# EAGLE design regA_regB_and_ALU (EAGLE 9.6.1)
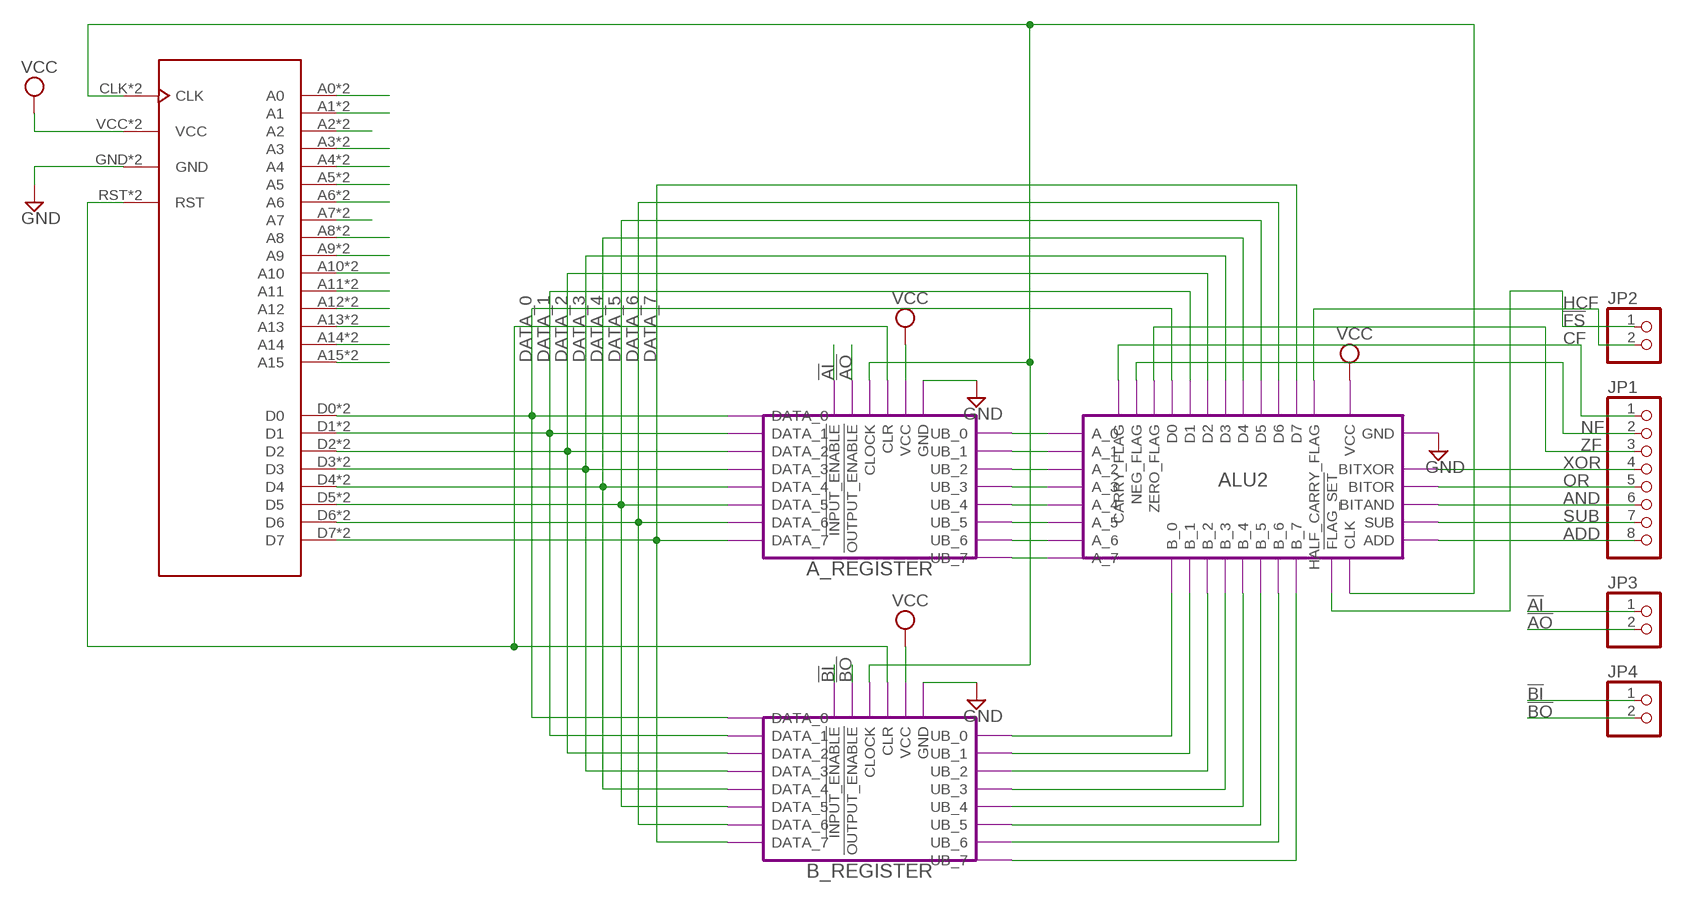
[diagram p0: schematic, sheet 1]

## Parts
JP1  PINHD-1X8/90  [1X08/90]
JP2  PINHD-1X2/90  [1X02/90]
JP3  PINHD-1X2/90  [1X02/90]
JP4  PINHD-1X2/90  [1X02/90]
U$1  PORT_BOARD  [PORT_FOOTPT]

## Module instances
A_REGISTER1 = DATA_REGISTOR
B_REGISTER1 = DATA_REGISTOR
ALU2 = ALU

## Nets
!AI: JP3.1 ; port A_REGISTER1.!INPUT_ENABLE
!AO: JP3.2 ; port A_REGISTER1.!OUTPUT_ENABLE
!BI: JP4.1 ; port B_REGISTER1.!INPUT_ENABLE
!BO: JP4.2 ; port B_REGISTER1.!OUTPUT_ENABLE
!FS: JP2.1 ; port ALU2.!FLAG_SET
ADD: JP1.8 ; port ALU2.ADD
AND: JP1.6 ; port ALU2.BITAND
CF: JP1.1 ; port ALU2.CARRY_FLAG
CLOCK1: U$1.CLK U$1.CLK1(CLK) ; port B_REGISTER1.CLOCK A_REGISTER1.CLOCK ALU2.CLK
DATA_0: U$1.D0 U$1.D8(D0) ; port A_REGISTER1.DATA_0 B_REGISTER1.DATA_0 ALU2.D0
DATA_1: U$1.D1 U$1.D9(D1) ; port A_REGISTER1.DATA_1 B_REGISTER1.DATA_1 ALU2.D1
DATA_2: U$1.D2 U$1.D10(D2) ; port A_REGISTER1.DATA_2 B_REGISTER1.DATA_2 ALU2.D2
DATA_3: U$1.D3 U$1.D11(D3) ; port A_REGISTER1.DATA_3 B_REGISTER1.DATA_3 ALU2.D3
DATA_4: U$1.D4 U$1.D12(D4) ; port A_REGISTER1.DATA_4 B_REGISTER1.DATA_4 ALU2.D4
DATA_5: U$1.D5 U$1.D13(D5) ; port A_REGISTER1.DATA_5 B_REGISTER1.DATA_5 ALU2.D5
DATA_6: U$1.D6 U$1.D14(D6) ; port A_REGISTER1.DATA_6 B_REGISTER1.DATA_6 ALU2.D6
DATA_7: U$1.D7 U$1.D15(D7) ; port A_REGISTER1.DATA_7 B_REGISTER1.DATA_7 ALU2.D7
GND: U$1.GND U$1.GND1(GND) ; port A_REGISTER1.GND B_REGISTER1.GND ALU2.GND
HCF: JP2.2 ; port ALU2.HALF_CARRY_FLAG
N$1: U$1.A15 U$1.A31(A15)
N$2: U$1.A14 U$1.A30(A14)
N$3: U$1.A13 U$1.A29(A13)
N$4: U$1.A12 U$1.A28(A12)
N$5: U$1.A11 U$1.A27(A11)
N$6: U$1.A10 U$1.A26(A10)
N$7: U$1.A9 U$1.A25(A9)
N$8: U$1.A8 U$1.A24(A8)
N$9: U$1.A7 U$1.A23(A7)
N$10: U$1.A6 U$1.A22(A6)
N$11: U$1.A5 U$1.A21(A5)
N$12: U$1.A4 U$1.A20(A4)
N$13: U$1.A3 U$1.A19(A3)
N$14: U$1.A2 U$1.A18(A2)
N$15: U$1.A1 U$1.A17(A1)
N$16: U$1.A0 U$1.A16(A0)
N$35: port A_REGISTER1.UB_0 ALU2.A_0
N$50: port A_REGISTER1.UB_1 ALU2.A_1
N$51: port A_REGISTER1.UB_2 ALU2.A_2
N$52: port A_REGISTER1.UB_3 ALU2.A_3
N$53: port A_REGISTER1.UB_4 ALU2.A_4
N$54: port A_REGISTER1.UB_5 ALU2.A_5
N$55: port A_REGISTER1.UB_6 ALU2.A_6
N$56: port A_REGISTER1.UB_7 ALU2.A_7
N$57: port B_REGISTER1.UB_0 ALU2.B_0
N$58: port B_REGISTER1.UB_1 ALU2.B_1
N$59: port ALU2.B_2 B_REGISTER1.UB_2
N$60: port B_REGISTER1.UB_3 ALU2.B_3
N$61: port ALU2.B_4 B_REGISTER1.UB_4
N$62: port B_REGISTER1.UB_5 ALU2.B_5
N$63: port ALU2.B_6 B_REGISTER1.UB_6
N$64: port B_REGISTER1.UB_7 ALU2.B_7
N$65: U$1.RST U$1.RST1(RST) ; port A_REGISTER1.CLR B_REGISTER1.CLR
NF: JP1.2 ; port ALU2.NEG_FLAG
OR: JP1.5 ; port ALU2.BITOR
SUB: JP1.7 ; port ALU2.SUB
VCC: U$1.VCC U$1.VCC1(VCC) ; port A_REGISTER1.VCC B_REGISTER1.VCC ALU2.VCC
XOR: JP1.4 ; port ALU2.BITXOR
ZF: JP1.3 ; port ALU2.ZERO_FLAG

## Library data of the parts
JP1 = pinhead:PINHD-1X8: PIN HEADER
JP2-JP4 = pinhead:PINHD-1X2: PIN HEADER
U$1 = stack_interface:PORT_BOARD

## Module DATA_REGISTOR
Ports: DATA_0(io) DATA_1(io) DATA_2(io) DATA_3(io) DATA_4(io) DATA_5(io) DATA_6(io) DATA_7(io) !INPUT_ENABLE(in) !OUTPUT_ENABLE(in) CLOCK(in) CLR(in) UB_0(out) UB_1(out) UB_2(out) UB_3(out) UB_4(out) UB_5(out) UB_6(out) UB_7(out) VCC(pwr) GND(pwr)
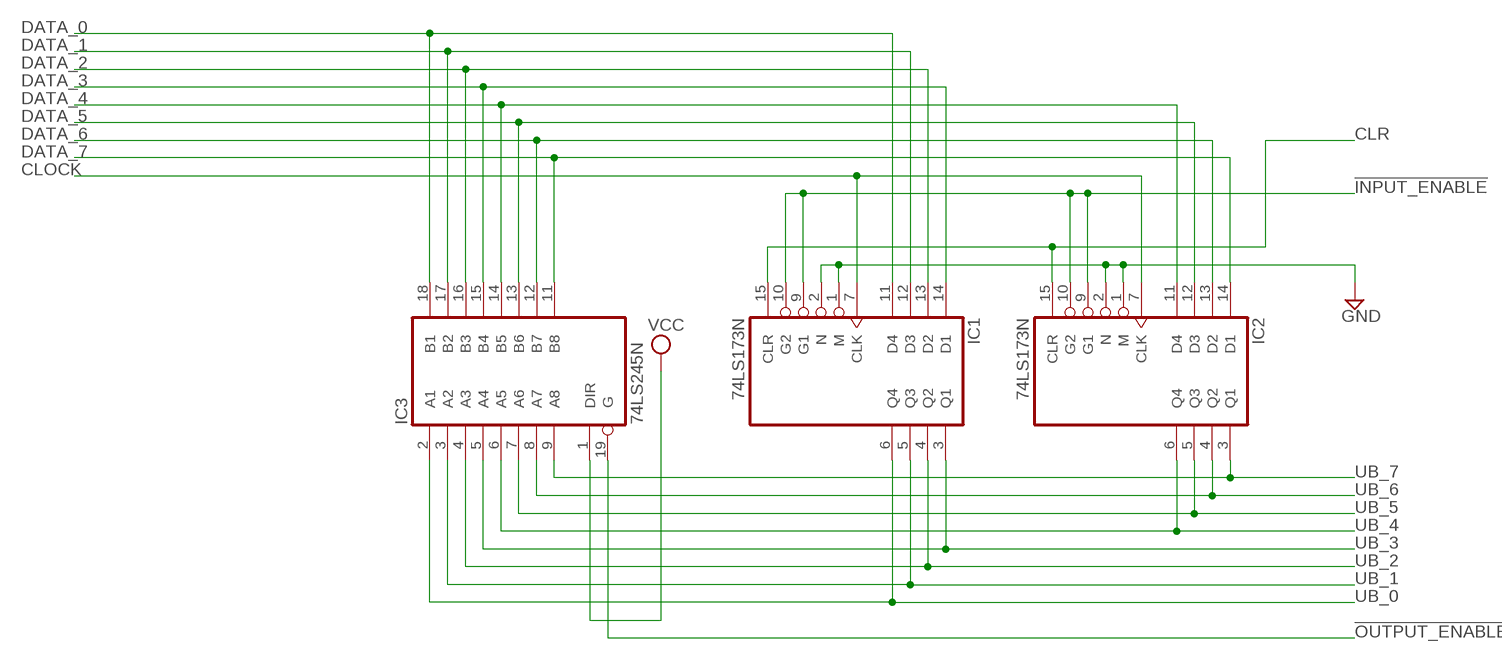
[diagram p1: schematic, module DATA_REGISTOR, sheet 1]

### Parts
IC1  74LS173N  [DIL16]
IC2  74LS173N  [DIL16]
IC3  74LS245N  [DIL20]

### Nets
!INPUT_ENABLE: IC1.9(G1) IC1.10(G2) IC2.9(G1) IC2.10(G2)
!OUTPUT_ENABLE: IC3.19(G)
CLOCK: IC1.7(CLK) IC2.7(CLK)
CLR: IC1.15(CLR) IC2.15(CLR)
DATA_0: IC1.11(D4) IC3.18(B1)
DATA_1: IC1.12(D3) IC3.17(B2)
DATA_2: IC1.13(D2) IC3.16(B3)
DATA_3: IC1.14(D1) IC3.15(B4)
DATA_4: IC2.11(D4) IC3.14(B5)
DATA_5: IC2.12(D3) IC3.13(B6)
DATA_6: IC2.13(D2) IC3.12(B7)
DATA_7: IC2.14(D1) IC3.11(B8)
GND: IC1.1(M) IC1.2(N) IC2.1(M) IC2.2(N)
UB_0: IC1.6(Q4) IC3.2(A1)
UB_1: IC1.5(Q3) IC3.3(A2)
UB_2: IC1.4(Q2) IC3.4(A3)
UB_3: IC1.3(Q1) IC3.5(A4)
UB_4: IC2.6(Q4) IC3.6(A5)
UB_5: IC2.5(Q3) IC3.7(A6)
UB_6: IC2.4(Q2) IC3.8(A7)
UB_7: IC2.3(Q1) IC3.9(A8)
VCC: IC3.1(DIR)

### Power pins joined to a net without a drawn wire
GND: IC1.8(GND) IC2.8(GND) IC3.10(GND)
VCC: IC1.16(VCC) IC2.16(VCC) IC3.20(VCC)

### Library data of the parts
IC1 IC2 = 74xx-eu:74*173: 4-bit D type REGISTER, 3-state
IC3 = 74xx-eu:74*245: Octal BUS TRANSCEIVER, 3-state

## Module ALU
Ports: A_0(in) A_1(in) A_2(in) A_3(in) A_4(in) A_5(in) A_6(in) A_7(in) B_0(in) B_1(in) B_2(in) B_3(in) B_4(in) B_5(in) B_6(in) B_7(in) ADD(in) SUB(in) BITAND(in) BITOR(in) BITXOR(in) D0(out) D1(out) D2(out) D3(out) D4(out) D5(out) D6(out) D7(out) GND(pwr) !FLAG_SET(in) CARRY_FLAG(out) NEG_FLAG(out) CLK(in) ZERO_FLAG(out) HALF_CARRY_FLAG(out) VCC(pwr)
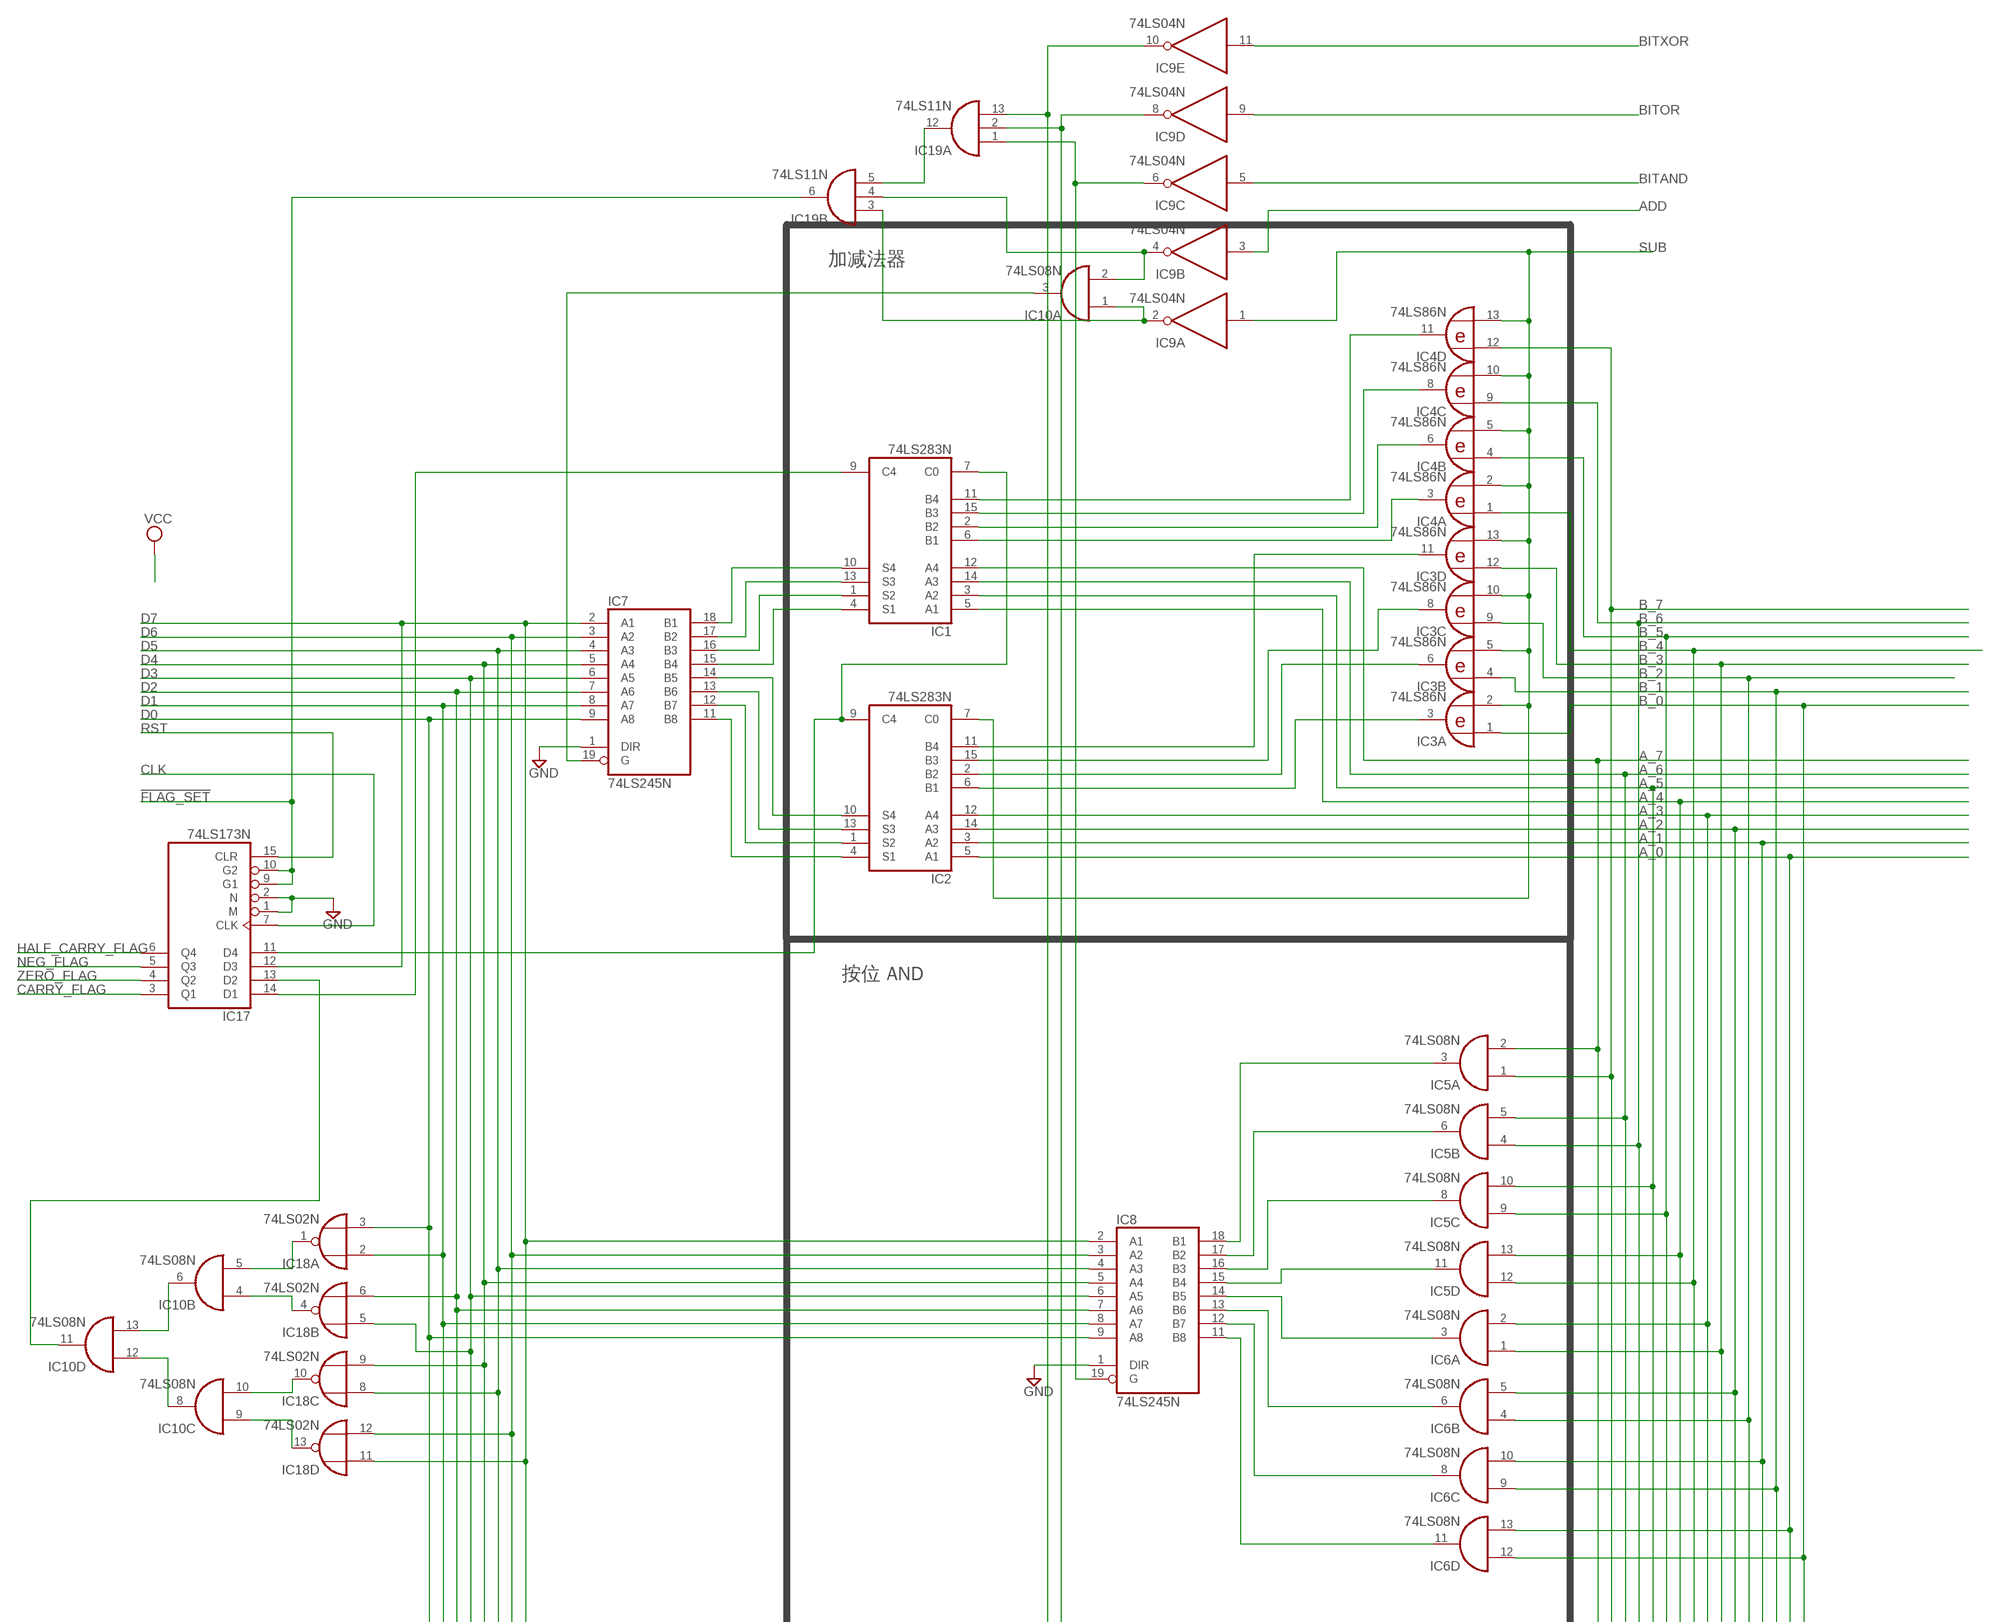
[diagram p2: schematic, module ALU, sheet 1, part 1 of 2]
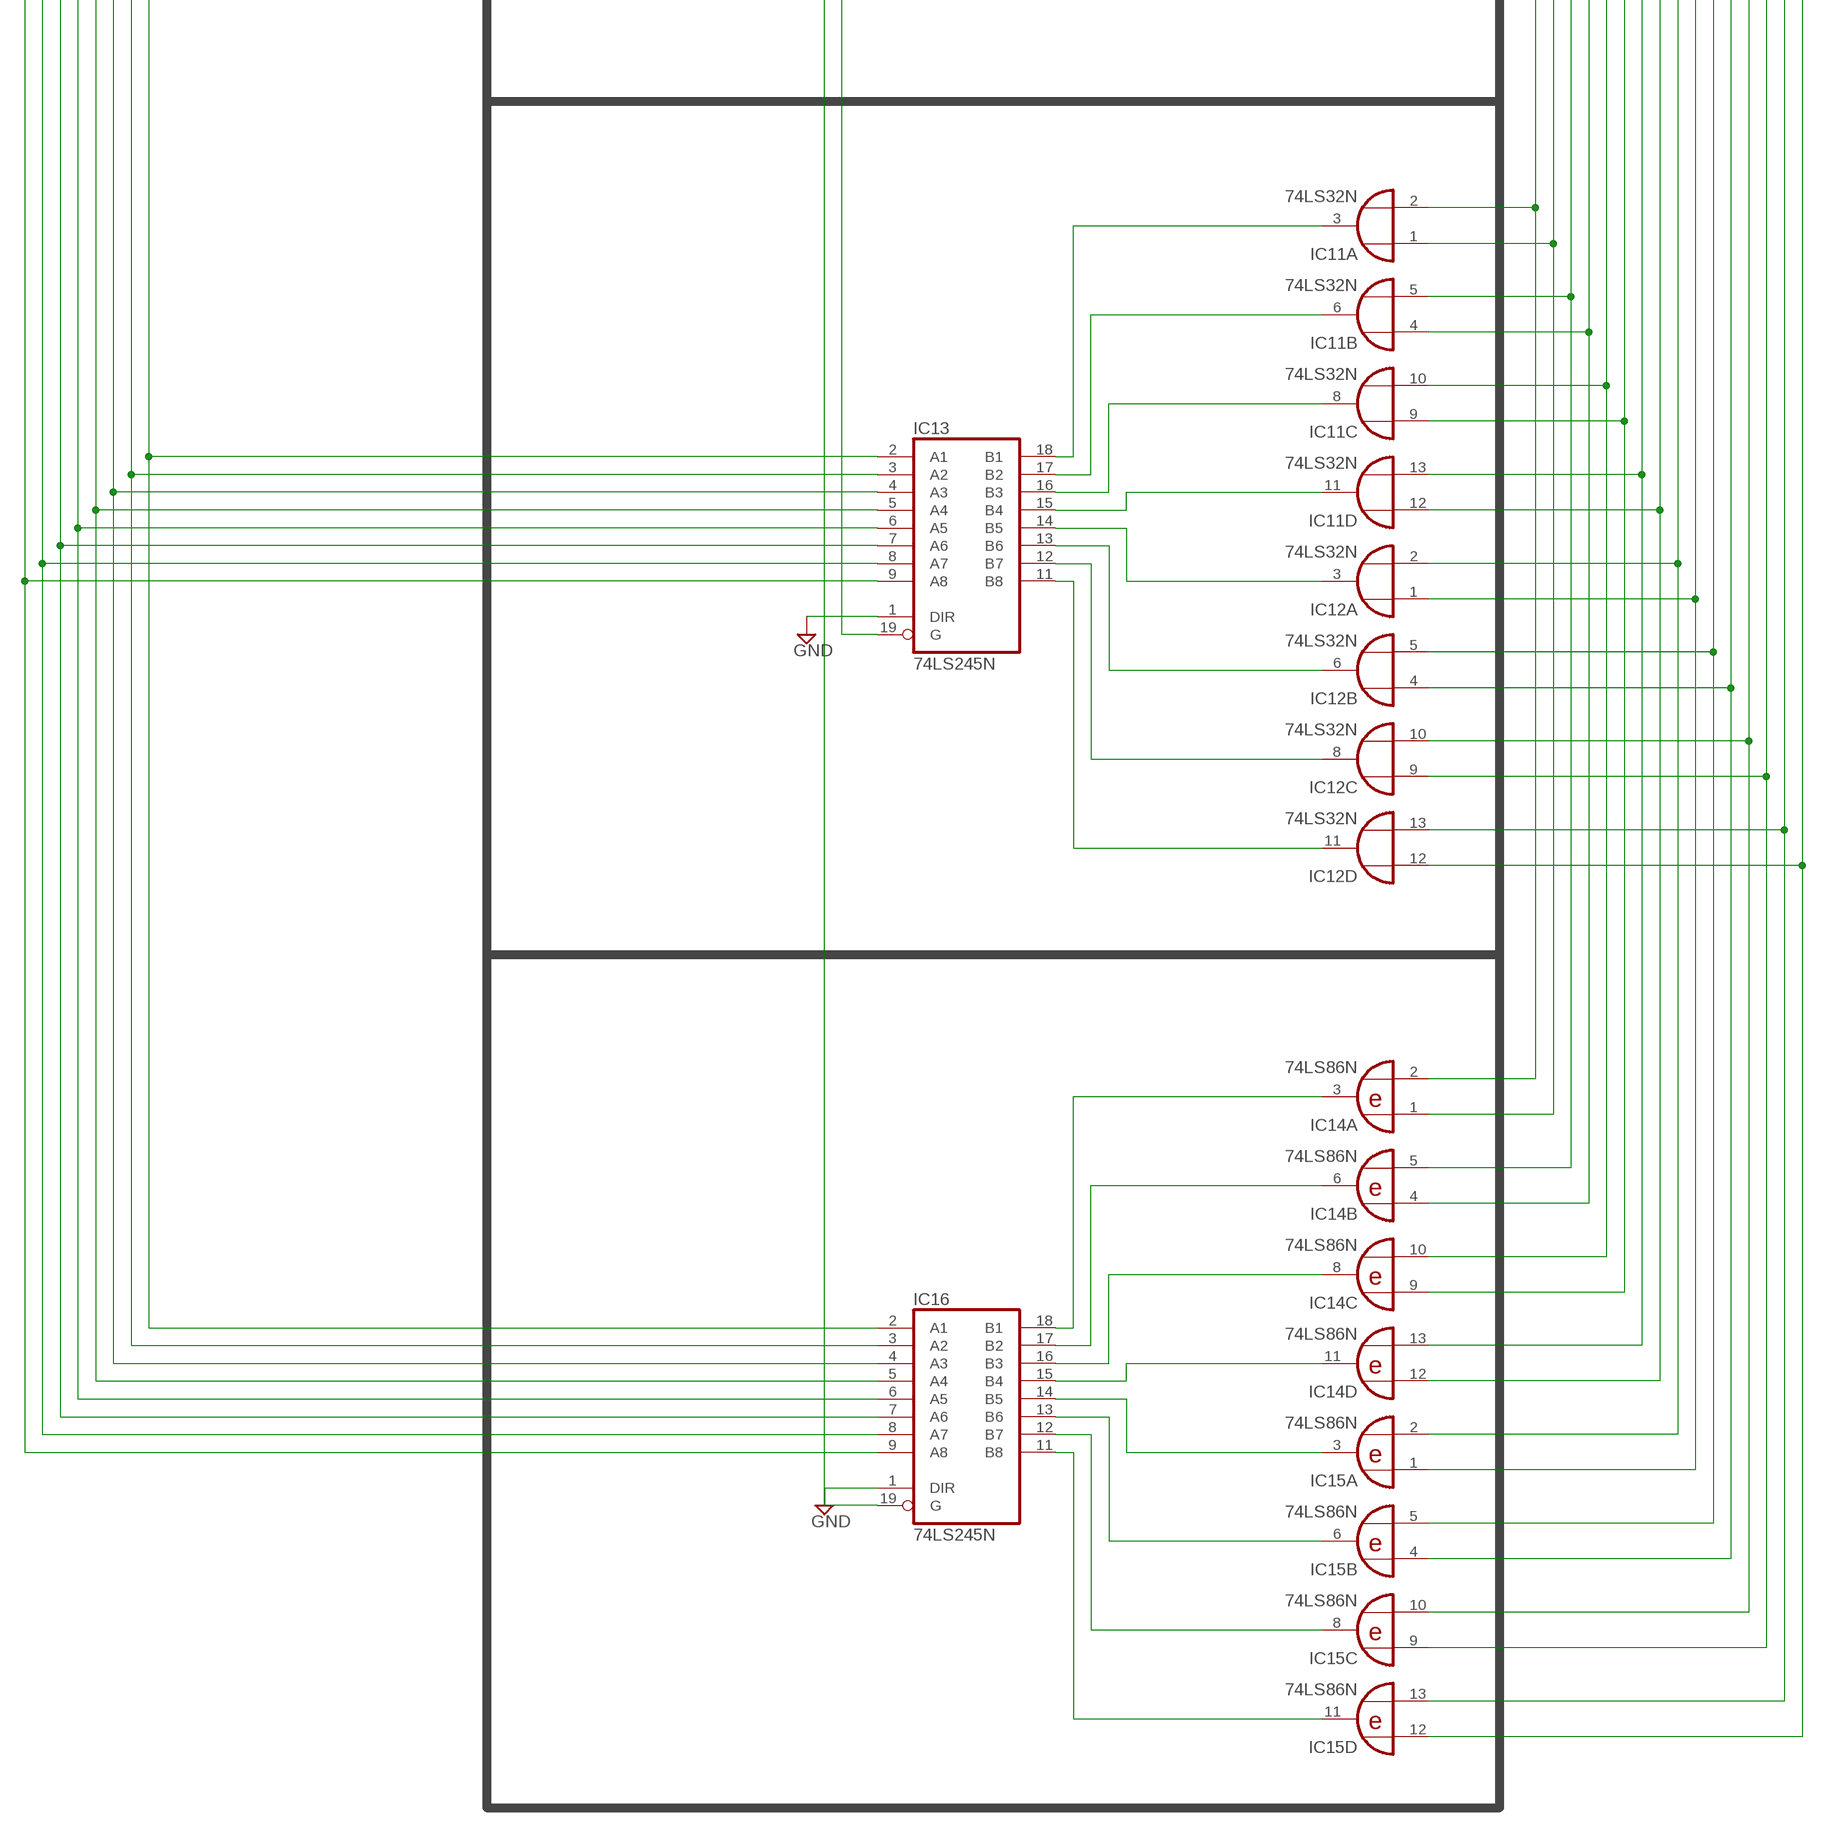
[diagram p3: schematic, module ALU, sheet 1, part 2 of 2]

### Parts
IC1  74LS283N  [DIL16]
IC2  74LS283N  [DIL16]
IC3  74LS86N  [DIL14]
IC4  74LS86N  [DIL14]
IC5  74LS08N  [DIL14]
IC6  74LS08N  [DIL14]
IC7  74LS245N  [DIL20]
IC8  74LS245N  [DIL20]
IC9  74LS04N  [DIL14]
IC10  74LS08N  [DIL14]
IC11  74LS32N  [DIL14]
IC12  74LS32N  [DIL14]
IC13  74LS245N  [DIL20]
IC14  74LS86N  [DIL14]
IC15  74LS86N  [DIL14]
IC16  74LS245N  [DIL20]
IC17  74LS173N  [DIL16]
IC18  74LS02N  [DIL14]
IC19  74LS11N  [DIL14]

### Nets
!FLAG_SET: IC17.9(G1) IC17.10(G2) IC19.6(B:O)
A_0: IC2.5(A1) IC6.13(D:I1) IC12.13(D:I1) IC15.13(D:I1)
A_1: IC2.3(A2) IC6.10(C:I1) IC12.10(C:I1) IC15.10(C:I1)
A_2: IC2.14(A3) IC6.5(B:I1) IC12.5(B:I1) IC15.5(B:I1)
A_3: IC2.12(A4) IC6.2(A:I1) IC12.2(A:I1) IC15.2(A:I1)
A_4: IC1.5(A1) IC5.13(D:I1) IC11.13(D:I1) IC14.13(D:I1)
A_5: IC1.3(A2) IC5.10(C:I1) IC11.10(C:I1) IC14.10(C:I1)
A_6: IC1.14(A3) IC5.5(B:I1) IC11.5(B:I1) IC14.5(B:I1)
A_7: IC1.12(A4) IC5.2(A:I1) IC11.2(A:I1) IC14.2(A:I1)
ADD: IC9.3(B:I)
B_0: IC3.1(A:I0) IC6.12(D:I0) IC12.12(D:I0) IC15.12(D:I0)
B_1: IC3.4(B:I0) IC6.9(C:I0) IC12.9(C:I0) IC15.9(C:I0)
B_2: IC3.9(C:I0) IC6.4(B:I0) IC12.4(B:I0) IC15.4(B:I0)
B_3: IC3.12(D:I0) IC6.1(A:I0) IC12.1(A:I0) IC15.1(A:I0)
B_4: IC4.1(A:I0) IC5.12(D:I0) IC11.12(D:I0) IC14.12(D:I0)
B_5: IC4.4(B:I0) IC5.9(C:I0) IC11.9(C:I0) IC14.9(C:I0)
B_6: IC4.9(C:I0) IC5.4(B:I0) IC11.4(B:I0) IC14.4(B:I0)
B_7: IC4.12(D:I0) IC5.1(A:I0) IC11.1(A:I0) IC14.1(A:I0)
BITAND: IC9.5(C:I)
BITOR: IC9.9(D:I)
BITXOR: IC9.11(E:I)
CARRY_FLAG: IC17.3(Q1)
CLK: IC17.7(CLK)
D0: IC7.9(A8) IC8.9(A8) IC13.9(A8) IC16.9(A8) IC18.3(A:I1)
D1: IC7.8(A7) IC8.8(A7) IC13.8(A7) IC16.8(A7) IC18.2(A:I0)
D2: IC7.7(A6) IC8.7(A6) IC13.7(A6) IC16.7(A6) IC18.6(B:I1)
D3: IC7.6(A5) IC8.6(A5) IC13.6(A5) IC16.6(A5) IC18.5(B:I0)
D4: IC7.5(A4) IC8.5(A4) IC13.5(A4) IC16.5(A4) IC18.9(C:I1)
D5: IC7.4(A3) IC8.4(A3) IC13.4(A3) IC16.4(A3) IC18.8(C:I0)
D6: IC7.3(A2) IC8.3(A2) IC13.3(A2) IC16.3(A2) IC18.12(D:I1)
D7: IC7.2(A1) IC8.2(A1) IC13.2(A1) IC16.2(A1) IC17.12(D3) IC18.11(D:I0)
GND: IC7.1(DIR) IC8.1(DIR) IC13.1(DIR) IC16.1(DIR) IC17.1(M) IC17.2(N)
HALF_CARRY_FLAG: IC17.6(Q4)
N$1: IC1.7(C0) IC2.9(C4) IC17.11(D4)
N$2: IC2.10(S4) IC7.14(B5)
N$3: IC1.4(S1) IC7.15(B4)
N$4: IC2.4(S1) IC7.11(B8)
N$5: IC2.1(S2) IC7.12(B7)
N$6: IC2.13(S3) IC7.13(B6)
N$7: IC1.1(S2) IC7.16(B3)
N$8: IC1.13(S3) IC7.17(B2)
N$9: IC1.10(S4) IC7.18(B1)
N$10: IC2.6(B1) IC3.3(A:O)
N$11: IC2.2(B2) IC3.6(B:O)
N$12: IC2.15(B3) IC3.8(C:O)
N$13: IC2.11(B4) IC3.11(D:O)
N$14: IC1.6(B1) IC4.3(A:O)
N$15: IC1.2(B2) IC4.6(B:O)
N$16: IC1.15(B3) IC4.8(C:O)
N$17: IC1.11(B4) IC4.11(D:O)
N$18: IC5.3(A:O) IC8.18(B1)
N$19: IC5.6(B:O) IC8.17(B2)
N$20: IC5.8(C:O) IC8.16(B3)
N$21: IC5.11(D:O) IC8.15(B4)
N$22: IC6.3(A:O) IC8.14(B5)
N$23: IC6.6(B:O) IC8.13(B6)
N$24: IC6.8(C:O) IC8.12(B7)
N$25: IC6.11(D:O) IC8.11(B8)
N$26: IC9.2(A:O) IC10.1(A:I0) IC19.3(B:I0)
N$27: IC9.4(B:O) IC10.2(A:I1) IC19.4(B:I1)
N$28: IC7.19(G) IC10.3(A:O)
N$29: IC8.19(G) IC9.6(C:O) IC19.1(A:I0)
N$30: IC11.3(A:O) IC13.18(B1)
N$31: IC14.3(A:O) IC16.18(B1)
N$32: IC11.8(C:O) IC13.16(B3)
N$33: IC11.11(D:O) IC13.15(B4)
N$34: IC12.3(A:O) IC13.14(B5)
N$35: IC12.6(B:O) IC13.13(B6)
N$36: IC12.8(C:O) IC13.12(B7)
N$37: IC12.11(D:O) IC13.11(B8)
N$38: IC9.8(D:O) IC13.19(G) IC19.2(A:I1)
N$39: IC11.6(B:O) IC13.17(B2)
N$40: IC14.6(B:O) IC16.17(B2)
N$41: IC14.8(C:O) IC16.16(B3)
N$42: IC14.11(D:O) IC16.15(B4)
N$43: IC15.3(A:O) IC16.14(B5)
N$44: IC15.6(B:O) IC16.13(B6)
N$45: IC15.8(C:O) IC16.12(B7)
N$46: IC15.11(D:O) IC16.11(B8)
N$47: IC9.10(E:O) IC16.19(G) IC19.13(A:I2)
N$48: IC1.9(C4) IC17.14(D1)
N$49: IC10.6(B:O) IC10.13(D:I1)
N$50: IC10.8(C:O) IC10.12(D:I0)
N$51: IC10.5(B:I1) IC18.1(A:O)
N$52: IC10.4(B:I0) IC18.4(B:O)
N$53: IC10.10(C:I1) IC18.10(C:O)
N$54: IC10.9(C:I0) IC18.13(D:O)
N$55: IC10.11(D:O) IC17.13(D2)
N$56: IC19.5(B:I2) IC19.12(A:O)
NEG_FLAG: IC17.5(Q3)
RST: IC17.15(CLR)
SUB: IC2.7(C0) IC3.2(A:I1) IC3.5(B:I1) IC3.10(C:I1) IC3.13(D:I1) IC4.2(A:I1) IC4.5(B:I1) IC4.10(C:I1) IC4.13(D:I1) IC9.1(A:I)
ZERO_FLAG: IC17.4(Q2)
Unconnected: IC9.12(F:O) IC9.13(F:I) IC19.8(C:O) IC19.9(C:I0) IC19.10(C:I1) IC19.11(C:I2)

### Notes on the sheet
- 加减法器
- 按位 AND

### Power pins joined to a net without a drawn wire
GND: IC1.8(GND) IC2.8(GND) IC3.7(P:GND) IC4.7(P:GND) IC5.7(P:GND) IC6.7(P:GND) IC7.10(GND) IC8.10(GND) IC9.7(P:GND) IC10.7(P:GND) IC11.7(P:GND) IC12.7(P:GND) IC13.10(GND) IC14.7(P:GND) IC15.7(P:GND) IC16.10(GND) IC17.8(GND) IC18.7(P:GND) IC19.7(P:GND)
VCC: IC1.16(VCC) IC2.16(VCC) IC3.14(P:VCC) IC4.14(P:VCC) IC5.14(P:VCC) IC6.14(P:VCC) IC7.20(VCC) IC8.20(VCC) IC9.14(P:VCC) IC10.14(P:VCC) IC11.14(P:VCC) IC12.14(P:VCC) IC13.20(VCC) IC14.14(P:VCC) IC15.14(P:VCC) IC16.20(VCC) IC17.16(VCC) IC18.14(P:VCC) IC19.14(P:VCC)

### Library data of the parts
IC1 IC2 = 74xx-eu:74*283: 4-bit binary FULL ADDER, fast carry
IC3 IC4 IC14 IC15 = 74xx-eu:74*86: Quad 2-input EXCLUSIVE-OR (XOR) gate
IC5 IC6 IC10 = 74xx-eu:74*08: Quad 2-input AND gate
IC7 IC8 IC13 IC16 = 74xx-eu:74*245: Octal BUS TRANSCEIVER, 3-state
IC9 = 74xx-eu:74*04: Hex INVERTER
IC11 = 74xx-eu:74*32: Quad 2-input OR gate; SPICEPREFIX: J
IC12 = 74xx-eu:74*32: Quad 2-input OR gate
IC17 = 74xx-eu:74*173: 4-bit D type REGISTER, 3-state
IC18 = 74xx-eu:74*02: Quad 2-input NOR gate
IC19 = 74xx-eu:74*11: Triple 3-input AND gate

## Board
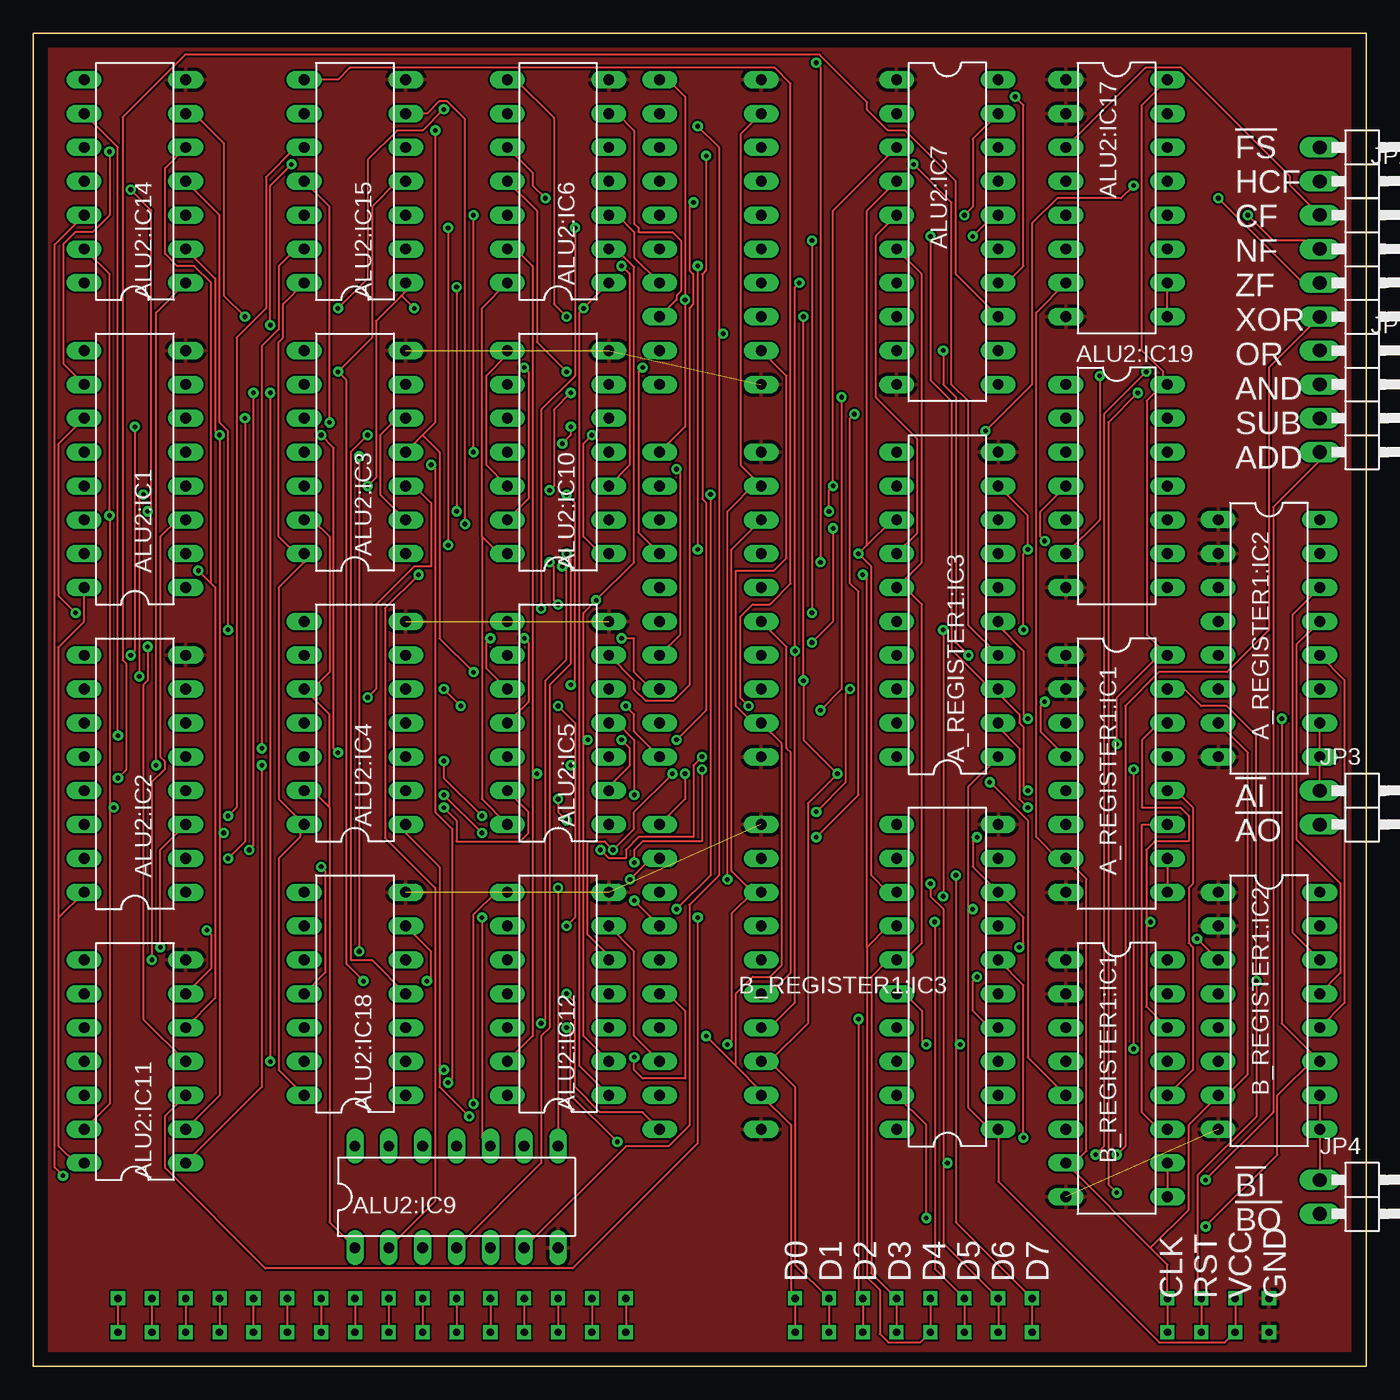
[diagram p4: board, top side]
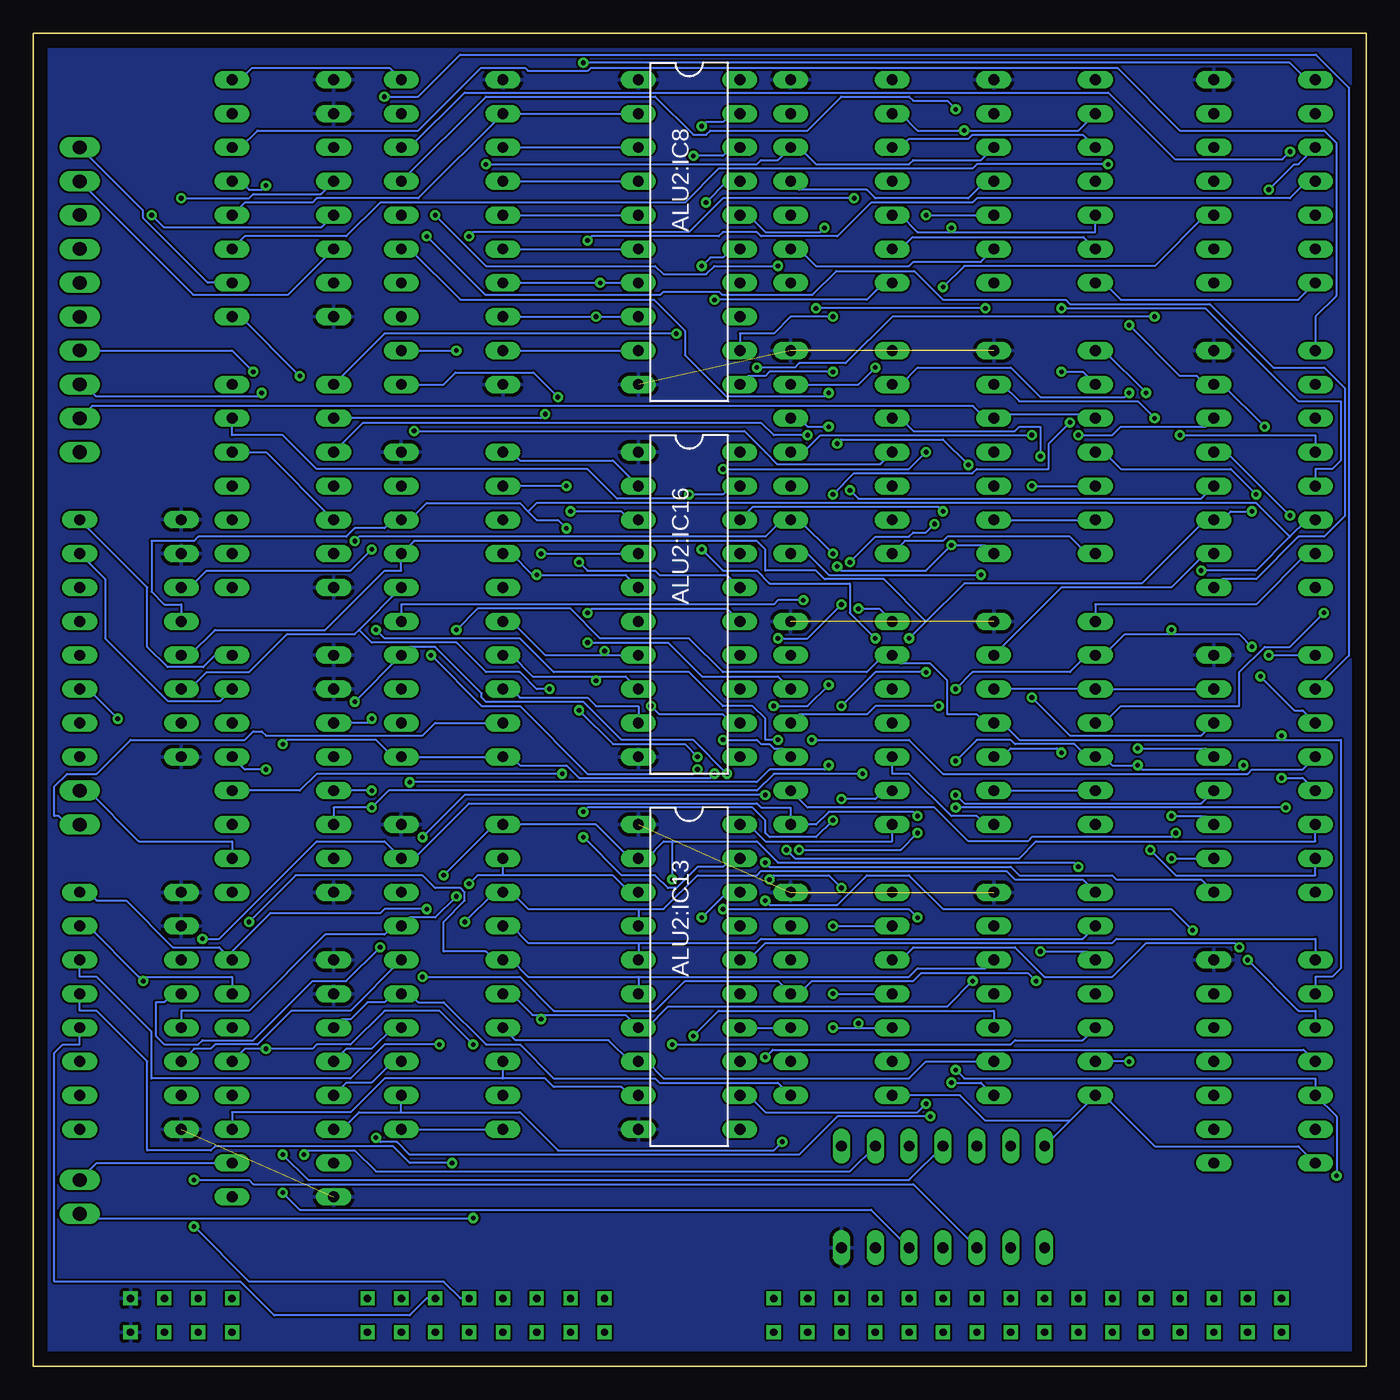
[diagram p5: board, bottom side, seen from below]

Size 100 x 100 mm. Coordinates in mm from the lower left corner, seen from the top.
Copper layers (1*16): Top 0.035mm / dielectric 1.5mm / Bottom 0.035mm
Design rules "default": minimum track width 6mil, minimum drill 0.35mm, track to track 6mil, track to pad 6mil, pad to pad 6mil, via to via 6mil, smd to smd 6mil, copper to edge 40mil, drill to drill 6mil, minimum pad ring 10mil, minimum via ring 8mil, stop-mask expansion 4mil, vias tented up to drill 0mil, thermal gap 10mil

### Footprints (pad centres in the part's own frame; a part is rotated, then mirrored left to right if it is on the bottom)
DIL16 = drill 0.813 long: 1 -8.89,-3.81; 2 -6.35,-3.81; 3 -3.81,-3.81; 4 -1.27,-3.81; 5 1.27,-3.81; 6 3.81,-3.81; 7 6.35,-3.81; 8 8.89,-3.81; 9 8.89,3.81; 10 6.35,3.81; 11 3.81,3.81; 12 1.27,3.81; 13 -1.27,3.81; 14 -3.81,3.81; 15 -6.35,3.81; 16 -8.89,3.81
DIL20 = drill 0.813 long: 1 -11.43,-3.81; 2 -8.89,-3.81; 3 -6.35,-3.81; 4 -3.81,-3.81; 5 -1.27,-3.81; 6 1.27,-3.81; 7 3.81,-3.81; 8 6.35,-3.81; 9 8.89,-3.81; 10 11.43,-3.81; 11 11.43,3.81; 12 8.89,3.81; 13 6.35,3.81; 14 3.81,3.81; 15 1.27,3.81; 16 -1.27,3.81; 17 -3.81,3.81; 18 -6.35,3.81; 19 -8.89,3.81; 20 -11.43,3.81
DIL14 = drill 0.813 long: 1 -7.62,-3.81; 2 -5.08,-3.81; 3 -2.54,-3.81; 4 0,-3.81; 5 2.54,-3.81; 6 5.08,-3.81; 7 7.62,-3.81; 8 7.62,3.81; 9 5.08,3.81; 10 2.54,3.81; 11 0,3.81; 12 -2.54,3.81; 13 -5.08,3.81; 14 -7.62,3.81
1X08/90 = drill 1.016 long: 1 -8.89,-3.81; 2 -6.35,-3.81; 3 -3.81,-3.81; 4 -1.27,-3.81; 5 1.27,-3.81; 6 3.81,-3.81; 7 6.35,-3.81; 8 8.89,-3.81
1X02/90 = drill 1.016 long: 1 -1.27,-3.81; 2 1.27,-3.81
PORT_FOOTPT = drill 0.55 square: A0 6.35,2.54; A1 8.89,2.54; A2 11.43,2.54; A3 13.97,2.54; A4 16.51,2.54; A5 19.05,2.54; A6 21.59,2.54; A7 24.13,2.54; A8 26.67,2.54; A9 29.21,2.54; A10 31.75,2.54; A11 34.29,2.54; A12 36.83,2.54; A13 39.37,2.54; A14 41.91,2.54; A15 44.45,2.54; A16 6.35,5.08; A17 8.89,5.08; A18 11.43,5.08; A19 13.97,5.08; A20 16.51,5.08; A21 19.05,5.08; A22 21.59,5.08; A23 24.13,5.08; A24 26.67,5.08; A25 29.21,5.08; A26 31.75,5.08; A27 34.29,5.08; A28 36.83,5.08; A29 39.37,5.08; A30 41.91,5.08; A31 44.45,5.08; CLK 85.09,2.54; CLK1 85.09,5.08; D0 57.15,2.54; D1 59.69,2.54; D2 62.23,2.54; D3 64.77,2.54; D4 67.31,2.54; D5 69.85,2.54; D6 72.39,2.54; D7 74.93,2.54; D8 57.15,5.08; D9 59.69,5.08; D10 62.23,5.08; D11 64.77,5.08; D12 67.31,5.08; D13 69.85,5.08; D14 72.39,5.08; D15 74.93,5.08; GND 92.71,2.54; GND1 92.71,5.08; RST 87.63,2.54; RST1 87.63,5.08; VCC 90.17,2.54; VCC1 90.17,5.08

### Placement (x,y rotation side)
A_REGISTER1:IC1  74LS173N  [DIL16]  81.28,44.45 270 top
A_REGISTER1:IC2  74LS173N  [DIL16]  92.71,54.61 270 top
A_REGISTER1:IC3  74LS245N  [DIL20]  68.58,57.15 90 top
ALU2:IC1  74LS283N  [DIL16]  7.62,67.31 90 top
ALU2:IC2  74LS283N  [DIL16]  7.62,44.45 90 top
ALU2:IC3  74LS86N  [DIL14]  24.13,68.58 90 top
ALU2:IC4  74LS86N  [DIL14]  24.13,48.26 90 top
ALU2:IC5  74LS08N  [DIL14]  39.37,48.26 90 top
ALU2:IC6  74LS08N  [DIL14]  39.37,88.9 90 top
ALU2:IC7  74LS245N  [DIL20]  68.58,85.09 270 top
ALU2:IC8  74LS245N  [DIL20]  50.8,85.09 270 bottom
ALU2:IC9  74LS04N  [DIL14]  31.75,12.7 0 top
ALU2:IC10  74LS08N  [DIL14]  39.37,68.58 90 top
ALU2:IC11  74LS32N  [DIL14]  7.62,22.86 90 top
ALU2:IC12  74LS32N  [DIL14]  39.37,27.94 90 top
ALU2:IC13  74LS245N  [DIL20]  50.8,29.21 270 bottom
ALU2:IC14  74LS86N  [DIL14]  7.62,88.9 90 top
ALU2:IC15  74LS86N  [DIL14]  24.13,88.9 90 top
ALU2:IC16  74LS245N  [DIL20]  50.8,57.15 270 bottom
ALU2:IC17  74LS173N  [DIL16]  81.28,87.63 270 top
ALU2:IC18  74LS02N  [DIL14]  24.13,27.94 90 top
ALU2:IC19  74LS11N  [DIL14]  81.28,66.04 270 top
B_REGISTER1:IC1  74LS173N  [DIL16]  81.28,21.59 270 top
B_REGISTER1:IC2  74LS173N  [DIL16]  92.71,26.67 270 top
B_REGISTER1:IC3  74LS245N  [DIL20]  68.58,29.21 90 top
JP1  100.33,77.47 270 top
JP2  100.33,90.17 270 top
JP3  100.33,41.91 270 top
JP4  100.33,12.7 270 top
U$1  0,0 0 top

### Tracks (layer width: path | path; a pad name or v marks a point on that pad's centre or on a via)
!AI
  Top 0.152: A_REGISTER1:IC1.10 A_REGISTER1:IC1.9 | JP3.1 A_REGISTER1:IC2.9 A_REGISTER1:IC2.10
  Bottom 0.152: A_REGISTER1:IC1.10 85.09,39.37 92.08,39.37 95.89,43.18 JP3.1
!AO
  Bottom 0.152: A_REGISTER1:IC3.19 69.85,48.26 70.8,47.31 82.55,47.31 82.87,47.62 83.5,47.62 84.14,46.99 92.71,46.99 95.25,44.45 97.47,44.45 98.42,43.5 98.42,41.27 98.11,41.27 97.47,40.64 JP3.2
!BI
  Top 0.152: B_REGISTER1:IC1.10 B_REGISTER1:IC1.9 | B_REGISTER1:IC2.10 B_REGISTER1:IC2.9 JP4.1
  Bottom 0.152: B_REGISTER1:IC1.10 95.25,15.24 JP4.1
!BO  (via drill 0.35)
  Top 0.152: B_REGISTER1:IC3.19 66.99,18.1 v66.99,11.11
  Bottom 0.152: v66.99,11.11 96.2,11.11 JP4.2
!FS  (via drill 0.35)
  Top 0.152: ALU2:IC19.6 80.01,63.5 v80.01,74.3 | ALU2:IC17.9 ALU2:IC17.10
  Bottom 0.152: v80.01,74.3 84.45,78.74 ALU2:IC17.9 | JP2.1 91.76,86.68 91.76,86.14 86.9,81.28 ALU2:IC17.10
ADD  (via drill 0.35)
  Top 0.152: v87.95,13.97 93.03,19.05 93.03,64.45 96.52,67.95 JP1.8
  Bottom 0.152: ALU2:IC9.3 33.97,13.65 83.5,13.65 83.82,13.97 v87.95,13.97
ALU2:N$1  (via drill 0.35)
  Top 0.152: v7.3,53.34 7.62,53.66 v7.62,70.48 | v19.37,90.17 17.78,88.58 v17.78,78.11
  Bottom 0.152: v7.3,53.34 ALU2:IC2.9 | v7.62,70.48 10.8,73.66 ALU2:IC1.7 12.06,73.66 12.7,74.3 13.97,74.3 v17.78,78.11 | ALU2:IC17.11 84.14,84.77 76.52,84.77 73.98,87.31 51.12,87.31 48.58,89.85 29.53,89.85 29.21,90.17 v19.37,90.17
ALU2:N$2  (via drill 0.35)
  Top 0.152: v73.66,95.25 74.3,94.62 74.3,82.55 73.03,81.28 ALU2:IC7.14
  Bottom 0.152: v73.66,95.25 71.12,95.25 67.97,98.4 3.77,98.4 1.3,95.92 1.3,53.31 ALU2:IC2.10
ALU2:N$3  (via drill 0.35)
  Top 0.152: v38.73,65.72 39.05,66.04 39.05,71.76 v40.32,73.03
  Bottom 0.152: ALU2:IC1.4 12.38,65.09 38.1,65.09 v38.73,65.72 | ALU2:IC7.15 71.75,83.82 67.94,80.01 53.43,80.01 51.12,77.69 51.12,75.87 48.02,72.77 40.58,72.77 v40.32,73.03
ALU2:N$4  (via drill 0.35)
  Top 0.152: v33.66,40 v30.8,42.86 | v42.55,38.73 43.18,38.1 44.45,38.1 44.45,38.73 45.4,39.69 49.53,39.69 49.53,45.08 v50.16,45.72 | v59.05,49.21 60.64,50.8 v60.64,72.71
  Bottom 0.152: ALU2:IC2.4 12.38,42.23 30.16,42.23 v30.8,42.86 | v33.66,40 34.92,38.73 v42.55,38.73 | v50.16,45.72 51.12,46.67 56.52,46.67 v59.05,49.21 | v60.64,72.71 62.48,74.55 68.33,74.55 69.22,73.66 ALU2:IC7.11
ALU2:N$5  (via drill 0.35)
  Top 0.152: v45.09,37.78 45.09,38.73 45.72,39.37 50.16,39.37 v50.16,44.77 | v70.17,53.34 69.22,54.29 69.22,72.71 68.26,73.66 v68.26,76.2
  Bottom 0.152: ALU2:IC2.1 12.38,36.51 18.73,36.51 19.05,36.83 26.03,36.83 26.67,37.46 44.77,37.46 v45.09,37.78 | v50.16,44.77 50.48,44.45 58.42,44.45 63.5,49.53 66.36,49.53 v70.17,53.34 | ALU2:IC7.12 v68.26,76.2
ALU2:N$6  (via drill 0.35)
  Top 0.152: ALU2:IC7.13 69.22,81.92 69.22,88.91 65.42,92.71 64.12,92.71 62.55,94.29 62.55,94.84 58.99,98.4 11.39,98.4 6.7,93.7 6.7,52.99 6.96,52.73 6.96,44.74 v6.35,44.13
  Bottom 0.152: ALU2:IC2.13 4.76,44.13 v6.35,44.13
ALU2:N$7  (via drill 0.35)
  Top 0.152: v70.48,84.77 72.07,86.36 ALU2:IC7.16
  Bottom 0.152: ALU2:IC1.1 10.8,59.05 8.25,59.05 5.08,62.23 3.16,62.23 1.6,63.79 1.6,73.37 3.16,74.93 6.98,74.93 11.75,79.69 22.22,79.69 22.54,80.01 31.75,80.01 33.91,82.17 39.75,82.17 41.53,80.39 48.32,80.39 48.55,80.62 52.73,80.62 52.96,80.39 66.1,80.39 v70.48,84.77
ALU2:N$8  (via drill 0.35)
  Top 0.152: v22.86,79.38 25.08,81.6 25.08,90.5 27.29,92.71 29.21,92.71 v30.8,94.3
  Bottom 0.152: ALU2:IC1.13 3.81,67.31 2.54,67.31 1.91,67.95 1.91,72.39 5.08,72.39 12.06,79.38 v22.86,79.38 | v30.8,94.3 31.43,94.93 33.97,94.93 34.29,95.25 39.37,95.25 41.91,92.71 49.21,92.71 49.53,92.39 50.48,92.39 53.34,95.25 66.04,95.25 ALU2:IC7.17
ALU2:N$9  (via drill 0.35)
  Top 0.152: v5.72,91.12 5.72,86.35 4.46,85.09 3.16,85.09 2.26,84.19 2.26,75.21 ALU2:IC1.10
  Bottom 0.152: ALU2:IC7.18 71.75,91.44 67.64,95.56 19.36,95.56 14.35,90.55 6.29,90.55 v5.72,91.12
ALU2:N$10  (via drill 0.35)
  Top 0.152: v25.08,50.16 25.72,50.8 25.72,57.15 28.58,60.01 29.84,60.01 29.84,64.77 28.58,66.04 ALU2:IC3.3
  Bottom 0.152: ALU2:IC2.6 12.38,47.31 22.22,47.31 v25.08,50.16
ALU2:N$11  (via drill 0.35)
  Top 0.152: v14.61,38.1 15.88,39.37 v15.88,71.12
  Bottom 0.152: v14.61,38.1 ALU2:IC2.2 | v15.88,71.12 17.14,72.39 26.03,72.39 27.31,73.66 ALU2:IC3.6
ALU2:N$12  (via drill 0.35)
  Top 0.152: v16.19,38.73 16.51,39.05 v16.51,73.03
  Bottom 0.152: ALU2:IC2.15 3.81,36.83 14.29,36.83 v16.19,38.73 | v16.51,73.03 19.69,76.2 ALU2:IC3.8
ALU2:N$13  (via drill 0.35)
  Top 0.152: v7.94,51.75 7.94,65.09 v8.25,65.41
  Bottom 0.152: ALU2:IC2.11 4.76,49.21 5.4,49.21 v7.94,51.75 | v8.25,65.41 10.16,67.31 18.42,67.31 19.69,68.58 ALU2:IC3.11
ALU2:N$14  (via drill 0.35)
  Top 0.152: v21.59,69.85 22.54,68.9 22.54,46.35 v22.86,46.04
  Bottom 0.152: ALU2:IC1.6 12.06,70.48 18.42,70.48 19.05,69.85 v21.59,69.85 | v22.86,46.04 23.18,46.35 26.67,46.35 27.31,45.72 ALU2:IC4.3
ALU2:N$15
  Bottom 0.152: ALU2:IC4.6 22.86,58.42 14.61,58.42 12.06,60.96 ALU2:IC1.2
ALU2:N$16
  Bottom 0.152: ALU2:IC4.8 20.32,57.15 8.25,57.15 4.45,60.96 ALU2:IC1.15
ALU2:N$17  (via drill 0.35)
  Top 0.152: ALU2:IC1.11 1.91,69.22 1.91,57.78 v3.17,56.51
  Bottom 0.152: v3.17,56.51 5.72,53.97 7.62,53.97 9.53,52.07 9.53,49.53 18.42,49.53 19.69,48.26 ALU2:IC4.11
ALU2:N$18  (via drill 0.35)
  Top 0.152: v50.48,90.81 50.48,82.23 50.19,81.94 50.19,65.06 50.45,64.8 50.45,49.18 v48.26,46.99
  Bottom 0.152: ALU2:IC5.3 43.81,46.35 44.45,46.35 44.77,46.67 45.4,46.67 45.72,46.99 v48.26,46.99 | v50.48,90.81 48.26,90.81 47.62,91.44 ALU2:IC8.18
ALU2:N$19  (via drill 0.35)
  Top 0.152: ALU2:IC5.6 45.09,51.43 45.09,50.79 45.96,49.91 48.02,49.91 49.21,51.1 49.21,79.38 49.5,79.66 49.5,81.94 49.24,82.2 49.24,87.02 v49.53,87.31
  Bottom 0.152: v49.53,87.31 47.94,88.9 ALU2:IC8.17
ALU2:N$20  (via drill 0.35)
  Top 0.152: v38.1,56.83 38.1,71.76 40.64,74.3 v40.64,85.41
  Bottom 0.152: ALU2:IC5.8 36.51,56.83 v38.1,56.83 | v40.64,85.41 40.96,85.09 45.09,85.09 46.36,86.36 ALU2:IC8.16
ALU2:N$21  (via drill 0.35)
  Top 0.152: ALU2:IC5.11 37.15,49.85 37.15,54.29 v36.83,54.61 | v49.85,82.55 v49.85,61.28
  Bottom 0.152: v36.83,54.61 38.73,56.51 38.73,58.74 44.77,58.74 45.72,59.69 48.26,59.69 v49.85,61.28 | v49.85,82.55 49.21,83.19 48.26,83.19 47.62,83.82 ALU2:IC8.15
ALU2:N$22
  Top 0.152: ALU2:IC8.14 45.09,83.19 45.09,85.09 43.81,86.36 ALU2:IC6.3
ALU2:N$23
  Top 0.152: ALU2:IC8.13 48.26,80.01 48.26,80.33 48.58,80.65 48.58,84.45 47.94,85.09 45.4,85.09 45.4,85.41 45.09,85.73 45.09,92.71 43.81,93.98 ALU2:IC6.6
ALU2:N$24  (via drill 0.35)
  Top 0.152: v40,78.74 39.05,79.69 39.05,93.66 36.2,96.52 ALU2:IC6.8
  Bottom 0.152: ALU2:IC8.12 46.99,77.47 44.45,77.47 43.18,78.74 v40,78.74
ALU2:N$25  (via drill 0.35)
  Top 0.152: v40,74.61 37.78,76.84 37.78,86.68 ALU2:IC6.11
  Bottom 0.152: ALU2:IC8.11 46.36,74.3 45.09,74.3 44.77,74.61 v40,74.61
ALU2:N$26  (via drill 0.35)
  Top 0.152: v41.91,69.85 41.28,69.22 41.28,62.23 42.55,60.96 ALU2:IC10.1 | v28.89,59.37 26.39,56.87 26.39,39.65 30.15,35.89 30.15,12.37 ALU2:IC9.2
  Bottom 0.152: v28.89,59.37 40.32,59.37 42.23,61.28 42.86,61.28 ALU2:IC10.1 | v41.91,69.85 44.45,69.85 45.37,70.77 75.28,70.77 ALU2:IC19.3
ALU2:N$27  (via drill 0.35)
  Top 0.152: ALU2:IC19.4 75.56,64.14 75.56,62.23 v75.88,61.91 | ALU2:IC9.4 38.1,15.24 38.1,24.77 38.73,25.4 38.73,51.12 40.31,52.69 40.31,60.65 v40,60.96
  Bottom 0.152: v40,60.96 42.55,63.5 ALU2:IC10.2 43.81,63.5 45.09,62.23 75.56,62.23 v75.88,61.91
ALU2:N$28  (via drill 0.35)
  Top 0.152: v69.85,86.36 70.48,87 70.48,92.08 ALU2:IC7.19 | v44.13,82.55 44.73,81.95 44.73,67.59 ALU2:IC10.3
  Bottom 0.152: v44.13,82.55 48.89,82.55 49.53,81.92 52.7,81.92 53.34,82.55 66.04,82.55 v69.85,86.36
ALU2:N$29  (via drill 0.35)
  Top 0.152: ALU2:IC9.6 44.45,16.51 47.64,16.51 49.21,18.09 49.21,34.61 51.44,36.83 51.44,77.47 | 51.44,77.47 51.44,91.44 v49.85,93.03 | 51.44,77.47 v51.75,77.47
  Bottom 0.152: v49.85,93.03 49.53,93.34 48.26,93.34 47.62,93.98 ALU2:IC8.19 | v51.75,77.47 73.66,77.47 ALU2:IC19.1
ALU2:N$30  (via drill 0.35)
  Top 0.152: v49.85,33.65 49.85,16.71 40.47,7.34 17.41,7.34 9.88,14.87 9.88,18.77 ALU2:IC11.3
  Bottom 0.152: v49.85,33.65 47.94,35.56 ALU2:IC13.18
ALU2:N$31  (via drill 0.35)
  Top 0.152: v31.75,80.96 v31.75,64.14
  Bottom 0.152: ALU2:IC16.18 46.04,64.45 32.07,64.45 v31.75,64.14 | v31.75,80.96 30.16,82.55 15.88,82.55 12.06,86.36 ALU2:IC14.3
ALU2:N$32
  Bottom 0.152: ALU2:IC11.8 3.81,32.07 18.73,32.07 19.05,31.75 45.09,31.75 46.36,30.48 ALU2:IC13.16
ALU2:N$33  (via drill 0.35)
  Top 0.152: v45.09,23.18 45.09,22.23 45.72,21.59 48.89,21.59 48.89,26.67 47.62,27.94 ALU2:IC13.15
  Bottom 0.152: v45.09,23.18 44.51,23.75 4.7,23.75 ALU2:IC11.11
ALU2:N$34
  Bottom 0.152: ALU2:IC13.14 ALU2:IC12.3
ALU2:N$35
  Top 0.152: ALU2:IC12.6 45.09,31.11 45.09,24.77 ALU2:IC13.13
ALU2:N$36  (via drill 0.35)
  Top 0.152: v33.02,19.68 33.02,33.88 34.7,35.56 ALU2:IC12.8
  Bottom 0.152: v33.02,19.68 33.66,19.05 45.09,19.05 46.36,20.32 ALU2:IC13.12
ALU2:N$37  (via drill 0.35)
  Top 0.152: v40,27.94 40.64,27.3 40.64,20.94 42.53,19.05 45.72,19.05 ALU2:IC13.11
  Bottom 0.152: v40,27.94 ALU2:IC12.11
ALU2:N$38  (via drill 0.35)
  Top 0.152: v39.37,35.88 ALU2:IC9.8 | v44.77,36.51 46.36,38.1 ALU2:IC13.19 | v61.59,71.44 61.28,71.12 61.28,58.74 61.91,58.1 61.91,42.86 v58.74,39.69
  Bottom 0.152: v39.37,35.88 40.32,36.83 44.45,36.83 v44.77,36.51 | ALU2:IC19.2 61.91,71.12 v61.59,71.44 | v58.74,39.69 55.88,36.83 53.34,36.83 52.39,35.88 51.75,35.88 50.16,37.46 48.26,37.46 47.62,38.1 ALU2:IC13.19
ALU2:N$39  (via drill 0.35)
  Top 0.152: ALU2:IC11.6 13.34,29.84 13.34,32.38 v13.02,32.7 | ALU2:IC13.17 v45.09,34.92
  Bottom 0.152: v13.02,32.7 14.61,34.29 31.75,34.29 34.29,36.83 37.47,36.83 39.69,34.61 44.77,34.61 v45.09,34.92
ALU2:N$40  (via drill 0.35)
  Top 0.152: ALU2:IC16.17 45.4,62.55 45.4,74.61 v45.72,74.93 | v15.88,78.74 14.29,80.33 14.29,91.76 12.06,93.98 ALU2:IC14.6
  Bottom 0.152: v45.72,74.93 42.86,74.93 42.55,75.25 39.05,75.25 35.56,78.74 v15.88,78.74
ALU2:N$41  (via drill 0.35)
  Top 0.152: v59.05,60.32 59.05,97.47 v58.74,97.79
  Bottom 0.152: ALU2:IC16.16 47.94,59.37 53.02,59.37 53.34,59.69 58.42,59.69 v59.05,60.32 | ALU2:IC14.8 4.45,96.52 5.72,97.79 v58.74,97.79
ALU2:N$42  (via drill 0.35)
  Top 0.152: v58.42,84.45 v58.42,56.51
  Bottom 0.152: ALU2:IC16.15 47.94,56.83 58.1,56.83 v58.42,56.51 | v58.42,84.45 58.1,84.77 48.58,84.77 48.26,85.09 45.72,85.09 45.4,84.77 39.69,84.77 37.15,87.31 29.53,87.31 29.21,87.63 5.72,87.63 4.45,88.9 ALU2:IC14.11
ALU2:N$43  (via drill 0.35)
  Top 0.152: v33.02,68.58 v33.02,86.36 | ALU2:IC16.14 48.54,54.89 48.54,67.03 v48.26,67.31
  Bottom 0.152: v33.02,86.36 ALU2:IC15.3 | v33.02,68.58 34.29,67.31 v48.26,67.31
ALU2:N$44  (via drill 0.35)
  Top 0.152: v38.73,60.32 39.05,60.01 39.05,57.47 v39.37,57.15 | v44.13,54.61 45.09,54.61 45.09,52.07 46.36,50.8 ALU2:IC16.13 | v32.39,63.18 32.39,93.57 31.05,94.9 30.45,94.9 29.53,93.98 ALU2:IC15.6
  Bottom 0.152: v32.39,63.18 33.02,62.55 33.97,62.55 34.29,62.23 36.83,62.23 v38.73,60.32 | v39.37,57.15 41.91,54.61 v44.13,54.61
ALU2:N$45  (via drill 0.35)
  Top 0.152: ALU2:IC15.8 22.86,96.52 23.75,97.41 55.64,97.41 56.82,96.23 56.82,58.71 55.26,57.15 53.96,57.15 53.06,56.25 53.06,50.13 v53.66,49.53
  Bottom 0.152: v53.66,49.53 53.02,48.89 48.26,48.89 47.62,48.26 ALU2:IC16.12
ALU2:N$46  (via drill 0.35)
  Top 0.152: ALU2:IC15.11 22.22,87 v22.22,70.8 | v40,65.41 40.64,64.77 40.64,51.43 v40.32,51.12 | v44.45,49.53 45.09,48.89 45.09,47.62 ALU2:IC16.11
  Bottom 0.152: v22.22,70.8 23.81,69.22 23.81,67.31 29.21,67.31 29.53,66.99 38.42,66.99 v40,65.41 | v40.32,51.12 41.91,49.53 v44.45,49.53
ALU2:N$47  (via drill 0.35)
  Top 0.152: ALU2:IC9.10 33.66,17.14 v33.66,33.65 | v48.26,34.29 50.8,36.83 v50.8,65.41
  Bottom 0.152: v33.66,33.65 34.29,34.29 v48.26,34.29 | ALU2:IC16.19 47.62,66.04 48.26,65.41 v50.8,65.41 51.12,65.09 56.2,65.09 58.42,67.31 78.74,67.31 81.28,69.85 85.09,69.85 ALU2:IC19.13
ALU2:N$48
  Bottom 0.152: ALU2:IC17.14 84.45,91.44 83.19,92.71 71.12,92.71 66.42,97.41 63.12,97.41 62.89,97.18 58.39,97.18 58.17,97.41 18.67,97.41 13.97,92.71 3.16,92.71 2.26,91.81 2.26,80.29 3.81,78.74 ALU2:IC1.9
ALU2:N$49  (via drill 0.35)
  Top 0.152: ALU2:IC10.13 37.15,65.09 37.15,74.61 v36.83,74.93
  Bottom 0.152: v36.83,74.93 38.1,73.66 ALU2:IC10.6
ALU2:N$50
  Top 0.152: ALU2:IC10.12 33.97,67.63 33.97,74.3 35.56,75.88 ALU2:IC10.8
ALU2:N$51  (via drill 0.35)
  Top 0.152: v31.11,21.27 31.43,21.59 31.43,40.32 30.16,41.59 30.16,67.31 v29.84,67.63 | v39.69,69.22 40.32,69.85 v40.32,70.48
  Bottom 0.152: ALU2:IC18.1 28.89,21.27 v31.11,21.27 | v29.84,67.63 31.75,69.53 39.37,69.53 v39.69,69.22 | v40.32,70.48 41.91,70.48 42.55,71.12 ALU2:IC10.5
ALU2:N$52  (via drill 0.35)
  Top 0.152: ALU2:IC18.4 25.4,30.48 23.81,30.48 23.81,68.58 v25.08,69.85
  Bottom 0.152: v25.08,69.85 40.96,69.85 42.23,68.58 ALU2:IC10.4
ALU2:N$53  (via drill 0.35)
  Top 0.152: v24.45,68.26 v24.45,31.11
  Bottom 0.152: ALU2:IC18.10 20.95,31.11 v24.45,31.11 | v24.45,68.26 24.45,70.48 26.03,70.48 26.35,70.17 33.97,70.17 34.92,71.12 ALU2:IC10.10
ALU2:N$54  (via drill 0.35)
  Top 0.152: v17.78,73.03 v17.78,22.86
  Bottom 0.152: v17.78,22.86 ALU2:IC18.13 | v17.78,73.03 18.1,72.71 24.45,72.71 26.67,74.93 33.66,74.93 34.92,73.66 ALU2:IC10.9
ALU2:N$55  (via drill 0.35)
  Top 0.152: v71.44,70.17 74.93,73.66 74.93,85.74 76.82,87.63 81.6,87.63 v82.55,88.58
  Bottom 0.152: v82.55,88.58 82.87,88.27 83.82,88.27 84.45,88.9 ALU2:IC17.13 | ALU2:IC10.11 36.45,67.69 44.21,67.69 45.09,68.57 45.09,68.59 46.66,70.17 v71.44,70.17
ALU2:N$56
  Bottom 0.152: ALU2:IC19.12 82.55,68.58 ALU2:IC19.5
AND  (via drill 0.35)
  Top 0.152: v81.28,13.02 80.65,13.65 80.65,70.8 v82.87,73.03
  Bottom 0.152: ALU2:IC9.5 37.15,11.75 80.01,11.75 v81.28,13.02 | JP1.6 96.2,73.66 95.31,72.77 83.12,72.77 v82.87,73.03
CF
  Top 0.152: JP1.1 94.3,88.58 94.3,89.23 86.12,97.41 83.44,97.41 ALU2:IC17.3
CLOCK1
  Top 0.152: U$1.CLK U$1.CLK1 85.09,7.62 83.82,8.89 | 83.82,8.89 77.79,14.92 | 77.79,14.92 B_REGISTER1:IC1.7 | ALU2:IC17.7 75.25,79.06 75.25,39.69 76.84,38.1 A_REGISTER1:IC1.7 79.02,36.55 79.02,16.15 77.79,14.92 | A_REGISTER1:IC2.7 91.12,46.04 91.12,21.91 89.53,20.32 B_REGISTER1:IC2.7 86.68,18.1 86.68,11.75 83.82,8.89
DATA_0  (via drill 0.35)
  Top 0.152: ALU2:IC8.9 56.52,74.3 56.52,60.64 55.56,59.69 52.7,59.69 52.7,49.53 53.98,48.26 ALU2:IC16.9 56.16,46.71 56.16,30.11 55.26,29.21 53.96,29.21 52.7,27.95 52.7,22.54 | U$1.D0 U$1.D8 56.83,5.4 56.83,18.1 ALU2:IC13.9 54.61,20.64 52.7,22.54 | 52.7,22.54 v50.48,24.77 | A_REGISTER1:IC1.11 83.19,40.64 83.19,19.05 84.45,17.78 B_REGISTER1:IC1.11
  Bottom 0.152: ALU2:IC7.9 ALU2:IC8.9 | ALU2:IC16.9 54.61,49.53 57.79,49.53 58.42,50.16 63.5,50.16 64.13,50.8 A_REGISTER1:IC3.18 | ALU2:IC18.3 27.94,26.67 48.58,26.67 v50.48,24.77 | 64.77,21.59 B_REGISTER1:IC3.18 | 64.77,21.59 61.59,21.59 60.96,20.96 55.88,20.96 55.25,20.32 ALU2:IC13.9 | B_REGISTER1:IC1.11 85.09,19.05 76.2,19.05 73.66,21.59 64.77,21.59
DATA_1  (via drill 0.35)
  Top 0.152: U$1.D1 U$1.D9 57.15,7.62 57.15,20.96 55.25,22.86 | B_REGISTER1:IC1.12 87,22.23 87,31.43 86.68,31.75 86.68,35.88 87,36.2 87,41.91 85.72,43.18 A_REGISTER1:IC1.12 | v57.79,78.74 v57.79,51.43 57.79,46.99 v60.33,44.45 58.1,42.23 58.1,25.72 55.25,22.86 | 55.25,22.86 ALU2:IC13.8
  Bottom 0.152: ALU2:IC18.2 33.02,22.86 34.29,21.59 52.7,21.59 53.98,22.86 ALU2:IC13.8 55.25,22.86 56.83,24.45 63.82,24.45 B_REGISTER1:IC3.17 | ALU2:IC7.8 v57.79,78.74 ALU2:IC8.8 | ALU2:IC16.8 55.56,51.75 57.79,51.75 | 57.79,51.75 62.55,51.75 64.13,53.34 A_REGISTER1:IC3.17 | 57.79,51.75 v57.79,51.43 | A_REGISTER1:IC1.12 80.01,43.18 78.74,44.45 v60.33,44.45
DATA_2  (via drill 0.35)
  Top 0.152: v57.47,81.28 57.15,80.96 v57.15,53.66 57.15,27.3 55.25,25.4 ALU2:IC13.7 | U$1.D2 U$1.D10 61.91,5.4 v61.91,26.04 | ALU2:IC18.6 29.84,31.11 29.84,29.21 v29.53,28.89 | v66.99,24.13 66.68,24.45 66.68,26.67 65.41,27.94 B_REGISTER1:IC3.16 | v82.55,23.81 v82.55,44.77
  Bottom 0.152: ALU2:IC7.7 v57.47,81.28 ALU2:IC8.7 | 57.15,53.34 61.59,53.34 64.13,55.88 A_REGISTER1:IC3.16 | 57.15,53.34 ALU2:IC16.7 | 57.15,53.34 v57.15,53.66 | 61.91,26.35 62.55,26.35 64.13,27.94 B_REGISTER1:IC3.16 | 61.91,26.35 55.56,26.35 ALU2:IC13.7 53.98,25.4 52.39,26.99 31.43,26.99 v29.53,28.89 | B_REGISTER1:IC1.13 84.14,23.81 v82.55,23.81 79.06,23.81 78.74,24.13 76.2,24.13 73.66,26.67 69.53,26.67 v66.99,24.13 | A_REGISTER1:IC1.13 84.14,44.77 v82.55,44.77 | 61.91,26.35 v61.91,26.04
DATA_3  (via drill 0.35)
  Top 0.152: B_REGISTER1:IC1.14 83.5,26.99 83.5,33.34 | 83.5,33.34 83.5,38.73 84.14,39.37 86.68,39.37 86.68,41.27 86.04,41.91 83.19,41.91 83.19,46.99 84.45,48.26 A_REGISTER1:IC1.14 | U$1.D3 U$1.D11 62.87,6.99 62.87,29.21 64.13,30.48 B_REGISTER1:IC3.15 65.41,30.48 66.68,31.75 66.68,57.15 65.09,58.74 | ALU2:IC16.6 56.52,53.97 56.52,46.35 56.83,46.04 56.83,29.53 55.25,27.94 ALU2:IC13.6 | v83.82,33.34 83.5,33.34 | 65.09,58.74 A_REGISTER1:IC3.15 | ALU2:IC7.6 66.62,81.97 66.62,60.27 65.09,58.74
  Bottom 0.152: ALU2:IC7.6 ALU2:IC8.6 | 54.61,29.21 ALU2:IC13.6 | 54.61,29.21 62.87,29.21 64.13,30.48 B_REGISTER1:IC3.15 65.41,30.48 66.04,31.11 69.22,31.11 69.22,33.34 67.63,34.92 67.63,35.56 67.94,35.88 69.85,35.88 70.8,36.83 80.33,36.83 v83.82,33.34 | ALU2:IC18.5 28.58,29.84 33.66,29.84 34.29,29.21 54.61,29.21
DATA_4  (via drill 0.35)
  Top 0.152: 96.2,23.18 93.66,25.72 v93.66,48.58 | U$1.D12 U$1.D4 66.55,1.78 64.15,1.78 63.5,2.43 63.5,5.71 62.55,6.67 62.55,31.43 | 62.55,31.43 64.13,33.02 B_REGISTER1:IC3.14 | 96.2,23.18 93.34,20.32 93.34,15.88 v87.95,10.48 | 96.2,23.18 B_REGISTER1:IC2.11 | v62.23,59.37 62.55,59.05 62.55,31.43 | A_REGISTER1:IC3.14 66.32,62.51 66.32,69.57 63.22,72.67 63.22,84.81 ALU2:IC7.5
  Bottom 0.152: ALU2:IC7.5 ALU2:IC8.5 | ALU2:IC16.5 55.56,59.37 v62.23,59.37 62.55,59.37 64.13,60.96 A_REGISTER1:IC3.14 | v93.66,48.58 95.89,50.8 A_REGISTER1:IC2.11 | 54.61,31.75 ALU2:IC13.5 | 54.61,31.75 62.87,31.75 64.13,33.02 B_REGISTER1:IC3.14 | ALU2:IC18.9 21.27,32.07 45.4,32.07 45.72,31.75 54.61,31.75 | v87.95,10.48 83.82,6.35 69.22,6.35 67.94,5.08 U$1.D12
DATA_5  (via drill 0.35)
  Top 0.152: 62.55,61.59 64.45,63.5 A_REGISTER1:IC3.13 | 62.55,61.59 v61.91,60.96 62.87,60.01 62.87,36.83 64.13,35.56 B_REGISTER1:IC3.13 | ALU2:IC7.4 62.55,86.68 62.55,61.59 | U$1.D5 U$1.D13 67.63,7.3 v67.63,33.34 | A_REGISTER1:IC2.12 98.37,51.49 98.37,27.25 B_REGISTER1:IC2.12
  Bottom 0.152: ALU2:IC7.4 ALU2:IC8.4 | v61.91,60.96 ALU2:IC16.4 | 54.61,34.29 ALU2:IC13.4 | 54.61,34.29 62.87,34.29 64.13,35.56 B_REGISTER1:IC3.13 65.41,35.56 v67.63,33.34 | ALU2:IC18.8 21.27,36.51 26.35,36.51 26.99,37.15 45.4,37.15 45.72,36.83 50.16,36.83 52.7,34.29 54.61,34.29 | B_REGISTER1:IC2.12 96.52,24.13 97.79,24.13 98.42,23.5 98.42,6.35 84.45,6.35 81.92,3.81 71.75,3.81 70.48,5.08 U$1.D13
DATA_6  (via drill 0.35)
  Top 0.152: U$1.D6 U$1.D14 68.26,9.21 68.26,15.24 | v52.07,24.13 52.39,24.45 52.39,33.97 53.98,35.56 | ALU2:IC16.3 52.39,61.28 52.39,37.15 53.98,35.56 | 53.98,35.56 ALU2:IC13.3 | v59.69,64.14 59.69,65.72 v60.01,66.04 60.01,86.68 ALU2:IC7.3 | 68.26,15.24 68.26,34.29 67.31,35.24 v67.31,36.2 | 68.26,15.24 v68.58,15.24 | A_REGISTER1:IC2.13 94.77,54.13 94.77,39.53 98.07,36.23 98.07,29.49 B_REGISTER1:IC2.13
  Bottom 0.152: ALU2:IC7.3 ALU2:IC8.3 | ALU2:IC18.12 21.27,24.45 26.35,24.45 26.67,24.13 v52.07,24.13 | 64.77,36.83 B_REGISTER1:IC3.12 | 64.77,36.83 56.52,36.83 55.25,35.56 ALU2:IC13.3 | v60.01,66.04 A_REGISTER1:IC3.12 | v59.69,64.14 55.88,64.14 55.25,63.5 ALU2:IC16.3 | v67.31,36.2 66.68,36.83 64.77,36.83 | B_REGISTER1:IC2.13 96.52,26.67 95.25,26.67 91.44,22.86 91.44,16.19 86.68,16.19 86.36,16.51 73.03,16.51 71.75,15.24 v68.58,15.24
DATA_7  (via drill 0.35)
  Top 0.152: U$1.D7 U$1.D15 69.22,10.79 69.22,24.13 | ALU2:IC18.11 21.91,29.53 21.91,37.15 v21.59,37.46 | v69.22,36.83 69.22,24.13 | 69.22,24.13 v69.53,24.13 | 54.29,66.36 52.07,64.14 v52.07,36.51 | 54.29,66.36 ALU2:IC16.2 | A_REGISTER1:IC2.14 94.46,56.36 94.46,32.54 B_REGISTER1:IC2.14 | ALU2:IC8.2 53.06,92.43 53.06,67.59 54.29,66.36
  Bottom 0.152: ALU2:IC16.2 56.52,67.95 63.5,67.95 64.13,68.58 A_REGISTER1:IC3.11 | ALU2:IC8.2 ALU2:IC7.2 71.12,87.63 78.74,87.63 79.06,87.31 84.14,87.31 ALU2:IC17.12 | v21.59,37.46 21.91,37.78 44.13,37.78 45.72,39.37 52.07,39.37 | 52.07,39.37 52.7,39.37 53.98,38.1 ALU2:IC13.2 55.25,38.1 57.79,40.64 B_REGISTER1:IC3.11 65.41,40.64 v69.22,36.83 | B_REGISTER1:IC2.14 96.52,29.21 95.25,29.21 91.12,25.08 91.12,21.59 76.2,21.59 73.66,24.13 v69.53,24.13 | 52.07,39.37 v52.07,36.51
GND  (6 unrouted)
  pour Top: 0,0 99.95,0 99.95,99.95 0,99.95
  pour Bottom: 0,0 99.95,0 99.95,99.95 0,99.95
HCF
  Bottom 0.152: JP2.2 88.01,80.39 80.9,80.39 ALU2:IC17.6
N$1
  Top 0.152: U$1.A31 U$1.A15
N$2
  Top 0.152: U$1.A30 U$1.A14
N$3
  Top 0.152: U$1.A29 U$1.A13
N$4
  Top 0.152: U$1.A28 U$1.A12
N$5
  Top 0.152: U$1.A27 U$1.A11
N$6
  Top 0.152: U$1.A26 U$1.A10
N$7
  Top 0.152: U$1.A25 U$1.A9
N$8
  Top 0.152: U$1.A24 U$1.A8
N$9
  Top 0.152: U$1.A23 U$1.A7
N$10
  Top 0.152: U$1.A22 U$1.A6
N$11
  Top 0.152: U$1.A21 U$1.A5
N$12
  Top 0.152: U$1.A20 U$1.A4
N$13
  Top 0.152: U$1.A19 U$1.A3
N$14
  Top 0.152: U$1.A18 U$1.A2
N$15
  Top 0.152: U$1.A17 U$1.A1
N$16
  Top 0.152: U$1.A16 U$1.A0
N$35  (via drill 0.35)
  Top 0.152: v17.14,46.35 17.14,76.52 18.42,77.79 18.42,82.55 19.69,83.82 ALU2:IC15.13 | v74.61,41.91 73.98,42.54 73.98,46.35 72.39,47.94 A_REGISTER1:IC3.2 | ALU2:IC12.13 37.47,24.77 37.47,44.45 | 37.47,44.45 37.47,82.55 36.2,83.82 ALU2:IC6.13 | 37.47,44.45 v37.78,44.45
  Bottom 0.152: ALU2:IC2.5 12.06,46.35 v17.14,46.35 | A_REGISTER1:IC1.6 77.47,41.91 v74.61,41.91 73.34,43.18 45.72,43.18 44.45,44.45 v37.78,44.45 | ALU2:IC6.13 34.92,83.82 34.04,84.71 21.21,84.71 ALU2:IC15.13
N$50  (via drill 0.35)
  Top 0.152: ALU2:IC2.3 9.53,38.73 v9.53,31.43 | v74.61,43.18 74.3,43.5 74.3,47.94 73.98,48.26 73.98,48.89 72.39,50.48 A_REGISTER1:IC3.3 71.85,50.8 68.9,53.75 68.9,72.39 67.31,73.98 v67.31,84.77 | v38.42,87.63 37.47,88.58 37.47,89.54 ALU2:IC6.10 | v14.61,41.27 15.24,41.91 15.24,77.15 17.46,79.38 17.46,89.22 19.69,91.44 ALU2:IC15.10
  Bottom 0.152: v9.53,31.43 9.84,31.75 16.51,31.75 19.05,29.21 24.13,29.21 26.35,31.43 33.97,31.43 34.92,30.48 ALU2:IC12.10 | v74.61,43.18 A_REGISTER1:IC1.5 | ALU2:IC15.10 21.27,92.39 29.53,92.39 29.84,92.08 34.29,92.08 34.92,91.44 ALU2:IC6.10 | v67.31,84.77 66.99,85.09 50.8,85.09 48.26,87.63 v38.42,87.63 | ALU2:IC2.3 12.06,41.27 v14.61,41.27
N$51  (via drill 0.35)
  Top 0.152: A_REGISTER1:IC1.4 75.56,47.62 75.56,49.53 v75.88,49.85 | ALU2:IC12.5 43.18,30.8 41.59,32.38 41.59,39.37 42.86,39.37 v43.5,38.73 45.09,40.32 45.09,41.59 v47.94,44.45 | v66.04,90.17 68.9,87.31 68.9,73.66 70.17,72.39 70.17,55.56 A_REGISTER1:IC3.4
  Bottom 0.152: ALU2:IC15.5 28.89,90.49 33.97,90.49 34.29,90.17 41.28,90.17 42.55,91.44 ALU2:IC6.5 44.13,90.49 45.4,90.49 45.72,90.17 v66.04,90.17 | v75.88,49.85 A_REGISTER1:IC3.4 71.75,53.97 69.85,53.97 66.36,50.48 66.36,50.16 66.04,49.85 58.74,49.85 55.88,46.99 50.48,46.99 v47.94,44.45 | ALU2:IC2.14 3.81,39.37 24.77,39.37 26.03,38.1 42.86,38.1 v43.5,38.73
N$52  (via drill 0.35)
  Top 0.152: v74.61,48.58 74.3,48.89 74.3,53.66 72.39,55.56 A_REGISTER1:IC3.5 | 41.28,46.67 v41.59,46.99 | 41.28,46.67 41.28,56.51 v42.23,57.47 45.07,60.31 45.07,82.47 43.72,83.82 ALU2:IC6.2 | ALU2:IC12.2 41.28,24.77 41.28,46.67
  Bottom 0.152: ALU2:IC15.2 28.89,82.87 33.97,82.87 34.29,82.55 41.28,82.55 42.55,83.82 ALU2:IC6.2 | A_REGISTER1:IC1.3 74.93,48.26 v74.61,48.58 | ALU2:IC2.12 4.76,44.77 8.57,44.77 8.89,44.45 31.75,44.45 34.29,46.99 v41.59,46.99 | A_REGISTER1:IC3.5 72.39,57.15 44.45,57.15 44.13,57.47 v42.23,57.47
N$53  (via drill 0.35)
  Top 0.152: ALU2:IC11.13 5.72,19.68 5.72,41.91 | 5.72,41.91 v5.72,63.82 5.72,81.92 ALU2:IC14.13 | ALU2:IC5.13 37.15,41.59 37.15,40 36.51,39.37 31.75,39.37 31.75,40.96 v30.8,41.91 | 5.72,41.91 v6.03,41.91 | v61.28,50.8 60.96,50.48 60.96,43.81 v58.74,41.59 | v40,40.96 39.37,41.59 v39.37,42.54
  Bottom 0.152: 75.56,55.24 75.88,54.93 80.96,54.93 83.82,52.07 87,52.07 88.27,50.8 A_REGISTER1:IC2.6 | 75.56,55.24 A_REGISTER1:IC3.6 | v5.72,63.82 10.48,68.58 ALU2:IC1.5 | v6.03,41.91 v30.8,41.91 | 75.56,55.24 74.61,54.29 68.26,54.29 66.04,52.07 63.5,52.07 62.23,50.8 v61.28,50.8 | v58.74,41.59 58.42,41.91 46.04,41.91 45.09,40.96 45.09,40 44.77,39.69 41.28,39.69 v40,40.96 | v39.37,42.54 36.83,42.54 36.2,43.18 ALU2:IC5.13
N$54  (via drill 0.35)
  Top 0.152: v8.89,30.48 8.89,43.81 9.84,44.77 9.84,45.4 9.53,45.72 9.53,62.23 10.8,63.5 ALU2:IC1.3 | ALU2:IC5.10 33.97,52.39 33.97,54.29 v34.29,54.61 | v8.57,64.14 8.86,64.42 8.86,86.71 v7.3,88.27
  Bottom 0.152: A_REGISTER1:IC2.5 88.27,53.34 86.36,55.24 78.11,55.24 73.66,59.69 72.39,59.69 A_REGISTER1:IC3.7 71.44,61.91 45.72,61.91 45.09,61.28 45.09,59.69 41.28,59.69 40.64,59.05 36.2,59.05 33.02,55.88 | ALU2:IC11.10 3.81,26.67 5.08,26.67 v8.89,30.48 | v7.3,88.27 5.4,90.17 5.08,90.17 ALU2:IC14.10 | v8.57,64.14 10.16,64.14 10.8,63.5 ALU2:IC1.3 12.06,63.5 16.83,58.74 30.16,58.74 33.02,55.88 | 33.02,55.88 v34.29,54.61
N$55  (via drill 0.35)
  Top 0.152: v58.42,54.29 60.01,55.88 v60.01,62.87 | ALU2:IC11.5 13.65,27.62 13.65,58.42 13.34,58.74 | v12.38,59.69 13.34,58.74 | 13.34,58.74 13.34,81.29 12.08,82.55 10.78,82.55 9.88,83.45 9.88,89.89 ALU2:IC14.5
  Bottom 0.152: ALU2:IC5.5 44.13,51.75 49.85,51.75 52.39,54.29 v58.42,54.29 | v60.01,62.87 60.64,63.5 62.23,63.5 62.87,64.14 | 62.87,64.14 63.5,64.77 70.48,64.77 71.75,63.5 A_REGISTER1:IC3.8 73.03,63.5 73.66,62.87 75.88,62.87 76.52,62.23 87.63,62.23 87.95,61.91 91.12,61.91 91.12,58.1 90.17,57.15 88.9,57.15 A_REGISTER1:IC2.4 | v12.38,59.69 8.25,59.69 5.72,62.23 | 5.72,62.23 4.45,63.5 ALU2:IC1.14 | 62.87,64.14 62.23,64.77 8.25,64.77 5.72,62.23
N$56  (via drill 0.35)
  Top 0.152: A_REGISTER1:IC3.9 74.61,63.82 v74.61,61.28 74.3,60.96 v74.3,55.24 | ALU2:IC11.2 13.97,20.32 13.97,40 | 13.97,40 v13.97,69.85 13.65,70.17 13.65,81.6 ALU2:IC14.2 | 13.97,40 v14.29,40 | v44.13,46.99 44.77,46.35 44.77,45.08 43.18,43.5 ALU2:IC5.2
  Bottom 0.152: v74.61,61.28 76.2,59.69 87,59.69 88.27,58.42 A_REGISTER1:IC2.3 | ALU2:IC1.12 3.81,69.85 v13.97,69.85 | ALU2:IC5.2 41.91,41.91 32.39,41.91 29.84,39.37 25.4,39.37 25.08,39.69 14.61,39.69 v14.29,40 | v74.3,55.24 73.66,54.61 63.5,54.61 60.96,52.07 50.8,52.07 48.26,49.53 46.04,49.53 45.09,48.58 45.09,46.99 v44.13,46.99
N$57  (via drill 0.35)
  Top 0.152: v31.11,85.41 v31.11,61.59 | v40,25.4 40.32,25.08 40.32,20.32 v43.81,16.83 | v39.69,60.01 40,59.69 40,53.02 38.42,51.43 38.42,26.04 v38.1,25.72
  Bottom 0.152: ALU2:IC15.12 20.32,85.09 31.11,85.09 | 31.11,85.09 33.66,85.09 34.92,86.36 ALU2:IC6.12 | ALU2:IC3.1 28.58,61.59 v31.11,61.59 33.02,59.69 39.37,59.69 v39.69,60.01 | 31.11,85.09 v31.11,85.41 | 72.39,19.05 B_REGISTER1:IC3.2 | 72.39,19.05 75.56,19.05 76.84,17.78 B_REGISTER1:IC1.6 | v40,25.4 38.1,25.4 | 38.1,25.4 ALU2:IC12.12 | v43.81,16.83 44.45,16.19 60.64,16.19 63.5,19.05 72.39,19.05 | 38.1,25.4 v38.1,25.72
N$58  (via drill 0.35)
  Top 0.152: 29.21,69.85 30.16,70.8 v30.16,92.71 | 29.21,69.85 ALU2:IC3.4 | v40,33.02 40.64,33.65 40.64,45.08 | 40.64,45.08 40.64,48.26 v39.37,49.53 | v33.02,52.07 30.48,54.61 30.48,68.58 29.21,69.85 | B_REGISTER1:IC1.5 74.61,23.18 74.61,40.96 v71.75,43.81 | 40.64,45.08 v40.32,45.08
  Bottom 0.152: B_REGISTER1:IC1.5 76.52,21.27 74.61,21.27 73.03,22.86 B_REGISTER1:IC3.3 | ALU2:IC6.9 34.92,93.98 33.66,92.71 v30.16,92.71 21.59,92.71 ALU2:IC15.9 | v40,33.02 ALU2:IC12.9 | v39.37,49.53 36.83,52.07 v33.02,52.07 | v71.75,43.81 45.72,43.81 44.77,44.77 40.64,44.77 v40.32,45.08
N$59  (via drill 0.35)
  Top 0.152: ALU2:IC15.4 27.31,88.9 25.4,87 25.4,77.15 v22.86,74.61 23.5,73.98 23.5,30.16 v24.77,28.89 | v70.8,29.21 70.48,28.89 70.48,26.67 71.75,25.4 B_REGISTER1:IC3.4
  Bottom 0.152: ALU2:IC3.9 21.27,74.61 v22.86,74.61 | ALU2:IC6.4 42.55,88.27 37.47,88.27 36.83,87.63 29.84,87.63 28.58,88.9 ALU2:IC15.4 | B_REGISTER1:IC1.4 76.52,23.81 74.61,23.81 73.03,25.4 B_REGISTER1:IC3.4 | v70.8,29.21 63.5,29.21 60.96,26.67 53.34,26.67 51.12,28.89 44.13,28.89 ALU2:IC12.4 42.55,27.94 41.59,28.89 33.97,28.89 33.37,29.5 25.37,29.5 v24.77,28.89
N$60  (via drill 0.35)
  Top 0.152: v25.08,66.04 25.72,66.67 25.72,78.42 27.62,80.33 | 27.62,80.33 27.94,80.65 ALU2:IC15.1 | ALU2:IC6.1 v41.28,79.38 40.97,79.07 40.97,22.53 ALU2:IC12.1 | 27.62,80.33 v28.58,79.38
  Bottom 0.152: v25.08,66.04 ALU2:IC3.12 | v28.58,79.38 v41.28,79.38 | ALU2:IC12.1 44.13,21.27 53.02,21.27 53.34,21.59 60.96,21.59 63.5,24.13 66.04,24.13 69.22,27.3 71.12,27.3 71.75,27.94 B_REGISTER1:IC3.5 73.03,27.94 73.66,27.3 74.93,27.3 76.2,26.04 76.84,26.04 B_REGISTER1:IC1.3
N$61  (via drill 0.35)
  Top 0.152: 30.48,22.54 v30.8,22.23 | 30.48,22.54 30.48,37.46 27.94,40 ALU2:IC4.1 | B_REGISTER1:IC3.6 74.3,28.57 v74.3,17.14 | v32.7,18.73 30.48,20.96 30.48,22.54 | v2.22,14.29 1.6,14.91 1.6,84.15 ALU2:IC14.12
  Bottom 0.152: B_REGISTER1:IC2.6 87.95,23.81 86.68,23.81 86.36,24.13 83.19,24.13 80.65,26.67 76.2,26.67 B_REGISTER1:IC3.6 | v30.8,22.23 30.16,21.59 3.81,21.59 ALU2:IC11.12 2.22,18.73 v2.22,14.29 | ALU2:IC5.12 35.56,44.45 34.29,44.45 31.11,41.27 29.21,41.27 28.58,40.64 ALU2:IC4.1 | v74.3,17.14 73.98,16.83 72.71,16.83 71.75,15.88 42.55,15.88 39.69,18.73 v32.7,18.73
N$62  (via drill 0.35)
  Top 0.152: ALU2:IC14.9 6.35,91.44 v6.35,47.31 | v68.26,55.24 v68.26,35.24
  Bottom 0.152: B_REGISTER1:IC2.5 88.9,26.67 83.82,26.67 78.11,32.38 73.66,32.38 73.03,33.02 B_REGISTER1:IC3.7 71.75,33.65 69.85,33.65 v68.26,35.24 | ALU2:IC11.9 3.81,29.21 2.54,29.21 1.91,29.84 1.91,46.99 6.35,46.99 | 6.35,46.99 26.03,46.99 27.31,48.26 ALU2:IC4.4 28.58,48.26 29.21,48.89 31.43,48.89 31.43,51.43 32.7,52.7 34.92,52.7 ALU2:IC5.9 36.2,53.34 37.47,52.07 48.26,52.07 50.8,54.61 57.47,54.61 59.69,56.83 66.68,56.83 v68.26,55.24 | 6.35,46.99 v6.35,47.31
N$63  (via drill 0.35)
  Top 0.152: v73.98,31.43 74.3,31.75 74.3,33.65 B_REGISTER1:IC3.8 70.48,37.46 70.48,39.37 v70.8,39.69 | ALU2:IC11.4 8.25,26.04 8.25,51.12 8.57,51.43 v8.57,53.97 | ALU2:IC14.4 13.97,86.36 13.97,70.8 14.61,70.17 v14.61,55.24 | v30.8,50.8 v32.07,49.53 | v45.09,42.86 45.09,46.99 43.81,48.26 ALU2:IC5.4
  Bottom 0.152: v73.98,31.43 76.52,28.89 79.06,28.89 83.5,24.45 87.31,24.45 87.63,24.13 90.17,24.13 90.81,24.77 90.81,27.3 90.17,27.3 89.53,27.94 B_REGISTER1:IC2.4 | v8.57,53.97 9.53,54.93 14.61,54.93 | 14.61,54.93 18.1,54.93 19.69,53.34 ALU2:IC4.9 20.95,53.34 22.22,52.07 29.53,52.07 v30.8,50.8 | 14.61,54.93 v14.61,55.24 | ALU2:IC5.4 42.55,48.89 37.47,48.89 36.83,49.53 v32.07,49.53 | v70.8,39.69 67.63,42.86 v45.09,42.86
N$64  (via drill 0.35)
  Top 0.152: B_REGISTER1:IC2.3 v87.31,32.07 | ALU2:IC11.1 17.14,20.96 v17.14,45.08 | ALU2:IC14.1 9.21,79.06 v9.21,45.08 | v33.66,41.27 30.8,44.13 v30.8,45.4
  Bottom 0.152: v87.31,32.07 86.04,32.07 78.74,39.37 73.66,39.37 B_REGISTER1:IC3.9 71.44,38.1 67.31,42.23 45.72,42.23 45.4,41.91 43.18,41.91 ALU2:IC5.1 41.28,40.64 40.32,41.59 33.97,41.59 v33.66,41.27 | v9.21,45.08 9.53,44.77 16.83,44.77 v17.14,45.08 19.05,45.08 19.69,45.72 ALU2:IC4.12 20.95,45.72 21.91,46.67 26.35,46.67 26.67,46.99 29.21,46.99 v30.8,45.4
N$65  (via drill 0.35)
  Top 0.152: U$1.RST U$1.RST1 87.34,5.37 87.34,14.3 91.76,18.72 v91.76,28.89 91.76,47.32 89.55,49.53 87.63,49.53 86.36,50.8 A_REGISTER1:IC1.15
  Bottom 0.152: B_REGISTER1:IC1.15 85.09,29.21 91.76,29.21 | 91.76,29.21 92.08,29.21 95.89,33.02 B_REGISTER1:IC2.15 | 91.76,29.21 v91.76,28.89 | A_REGISTER1:IC2.15 94.62,59.05 94.62,54.6 89.93,49.91 85.98,49.91 A_REGISTER1:IC1.15
NF  (via drill 0.35)
  Top 0.152: v91.12,86.36 93.03,84.45 95.89,84.45 JP1.2
  Bottom 0.152: v91.12,86.36 90.23,85.47 78.36,85.47 ALU2:IC17.5
OR  (via drill 0.35)
  Top 0.152: v79.69,15.88 80.33,16.51 80.33,71.44 v83.5,74.61
  Bottom 0.152: ALU2:IC9.9 38.73,14.61 74.3,14.61 75.88,16.19 79.38,16.19 v79.69,15.88 | JP1.5 85.09,76.2 v83.5,74.61
SUB
  Top 0.152: 22.22,41.91 20.95,43.18 ALU2:IC4.13 | 20.64,50.48 22.22,48.89 22.22,41.91 | ALU2:IC3.2 26.03,65.41 26.03,69.85 27.31,71.12 ALU2:IC3.5 | 20.64,50.48 22.22,52.07 22.22,62.23 20.95,63.5 ALU2:IC3.13 | 20.64,50.48 ALU2:IC4.10 | 22.22,41.91 22.22,10.79 ALU2:IC9.1
  Bottom 0.152: ALU2:IC2.7 ALU2:IC4.10 ALU2:IC4.5 | ALU2:IC4.2 ALU2:IC4.13 | ALU2:IC3.2 ALU2:IC3.13 | ALU2:IC3.10 20.64,71.44 27.62,71.44 ALU2:IC3.5 28.58,71.12 29.5,72.04 95.6,72.04 JP1.7
VCC  (via drill 0.35)
  Top 0.152: 1.91,33.65 ALU2:IC2.16 | 1.91,33.65 1.91,16.51 3.17,15.24 ALU2:IC11.14 | ALU2:IC1.16 3.81,55.88 1.91,53.97 1.91,33.65 | ALU2:IC16.20 48.89,70.48 v48.89,80.01 48.89,95.25 47.62,96.52 ALU2:IC8.20 | 20,40.96 18.42,42.54 18.42,58.42 20.32,60.32 | ALU2:IC6.14 33.66,79.38 33.66,62.23 | 33.66,62.23 34.92,60.96 ALU2:IC10.14 | ALU2:IC5.14 33.66,42.54 33.66,62.23 | ALU2:IC15.14 18.73,79.69 18.73,77.15 18.42,76.84 18.42,62.23 20.32,60.32 | 20.32,60.32 ALU2:IC3.14 | ALU2:IC18.14 18.42,22.23 18.42,38.1 20,39.69 20,40.96 | 20,40.96 ALU2:IC4.14 | ALU2:IC17.16 83.19,94.62 83.19,76.2 84.77,74.61 84.77,73.66 | 84.77,73.66 ALU2:IC19.14 | U$1.VCC1 U$1.VCC 89.41,1.78 84.47,1.78 72.39,13.86 72.39,17.14 | A_REGISTER1:IC3.1 70.17,43.5 70.17,34.29 | 70.17,34.29 70.17,19.37 72.39,17.14 | 72.39,17.14 B_REGISTER1:IC3.1 | 70.17,34.29 v70.48,34.29 | 84.77,53.66 81.28,50.16 v81.28,46.67 | 84.77,53.66 A_REGISTER1:IC1.16 | ALU2:IC13.20 48.89,42.54 v48.89,44.45 | 84.77,73.66 83.54,72.43 83.54,54.89 84.77,53.66
  Bottom 0.152: 22.22,18.41 ALU2:IC18.14 19.69,20.32 15.88,16.51 5.08,16.51 ALU2:IC11.14 | 22.22,18.41 ALU2:IC9.14 | ALU2:IC12.14 30.48,20.32 28.58,18.41 22.22,18.41 | ALU2:IC14.14 5.08,80.01 18.42,80.01 19.69,81.28 ALU2:IC15.14 | ALU2:IC5.14 35.56,39.37 45.09,39.37 46.36,40.64 ALU2:IC13.20 | ALU2:IC10.14 34.61,61.91 31.75,61.91 31.43,62.23 22.22,62.23 20.95,60.96 ALU2:IC3.14 | v48.89,80.01 37.47,80.01 36.2,81.28 ALU2:IC6.14 | ALU2:IC17.16 84.45,96.52 83.57,97.41 73.28,97.41 ALU2:IC7.20 | 85.41,30.8 86.04,31.43 89.53,31.43 93.03,34.92 95.25,34.92 95.89,35.56 B_REGISTER1:IC2.16 | B_REGISTER1:IC3.1 B_REGISTER1:IC3.20 | 85.41,30.8 82.23,33.97 73.98,33.97 73.66,34.29 v70.48,34.29 | 85.41,30.8 B_REGISTER1:IC1.16 | v81.28,46.67 80.96,46.99 74.3,46.99 73.03,45.72 A_REGISTER1:IC3.1 A_REGISTER1:IC3.20 64.13,45.72 63.5,45.08 60.01,45.08 59.05,44.13 49.21,44.13 v48.89,44.45 | A_REGISTER1:IC2.16 91.44,58.42 91.44,53.96 89.93,52.45 87.25,52.45 86.36,53.34 A_REGISTER1:IC1.16
XOR  (via drill 0.35)
  Top 0.152: v81.28,15.88 81.92,16.51 81.92,49.54 84.44,52.07 89.55,52.07 92.71,55.23 92.71,74.93 JP1.4
  Bottom 0.152: ALU2:IC9.11 34.29,13.97 79.38,13.97 v81.28,15.88
ZF  (via drill 0.35)
  Top 0.152: v88.9,87.63 95.25,81.28 JP1.3
  Bottom 0.152: ALU2:IC17.4 78.42,87.95 83.5,87.95 83.82,87.63 v88.9,87.63

### Text on the board
tNames: !FS / HCF / CF / NF / ZF / XOR / OR / AND / SUB / ADD | !AI / !AO | !BI / !BO | D0 / D1 / D2 / D3 / D4 / D5 / D6 / D7 | CLK / RST / VCC / GND